# EAGLE schematic Tracker_v5B (EAGLE 9.6.2)

## Sheet 1 of 8: Title
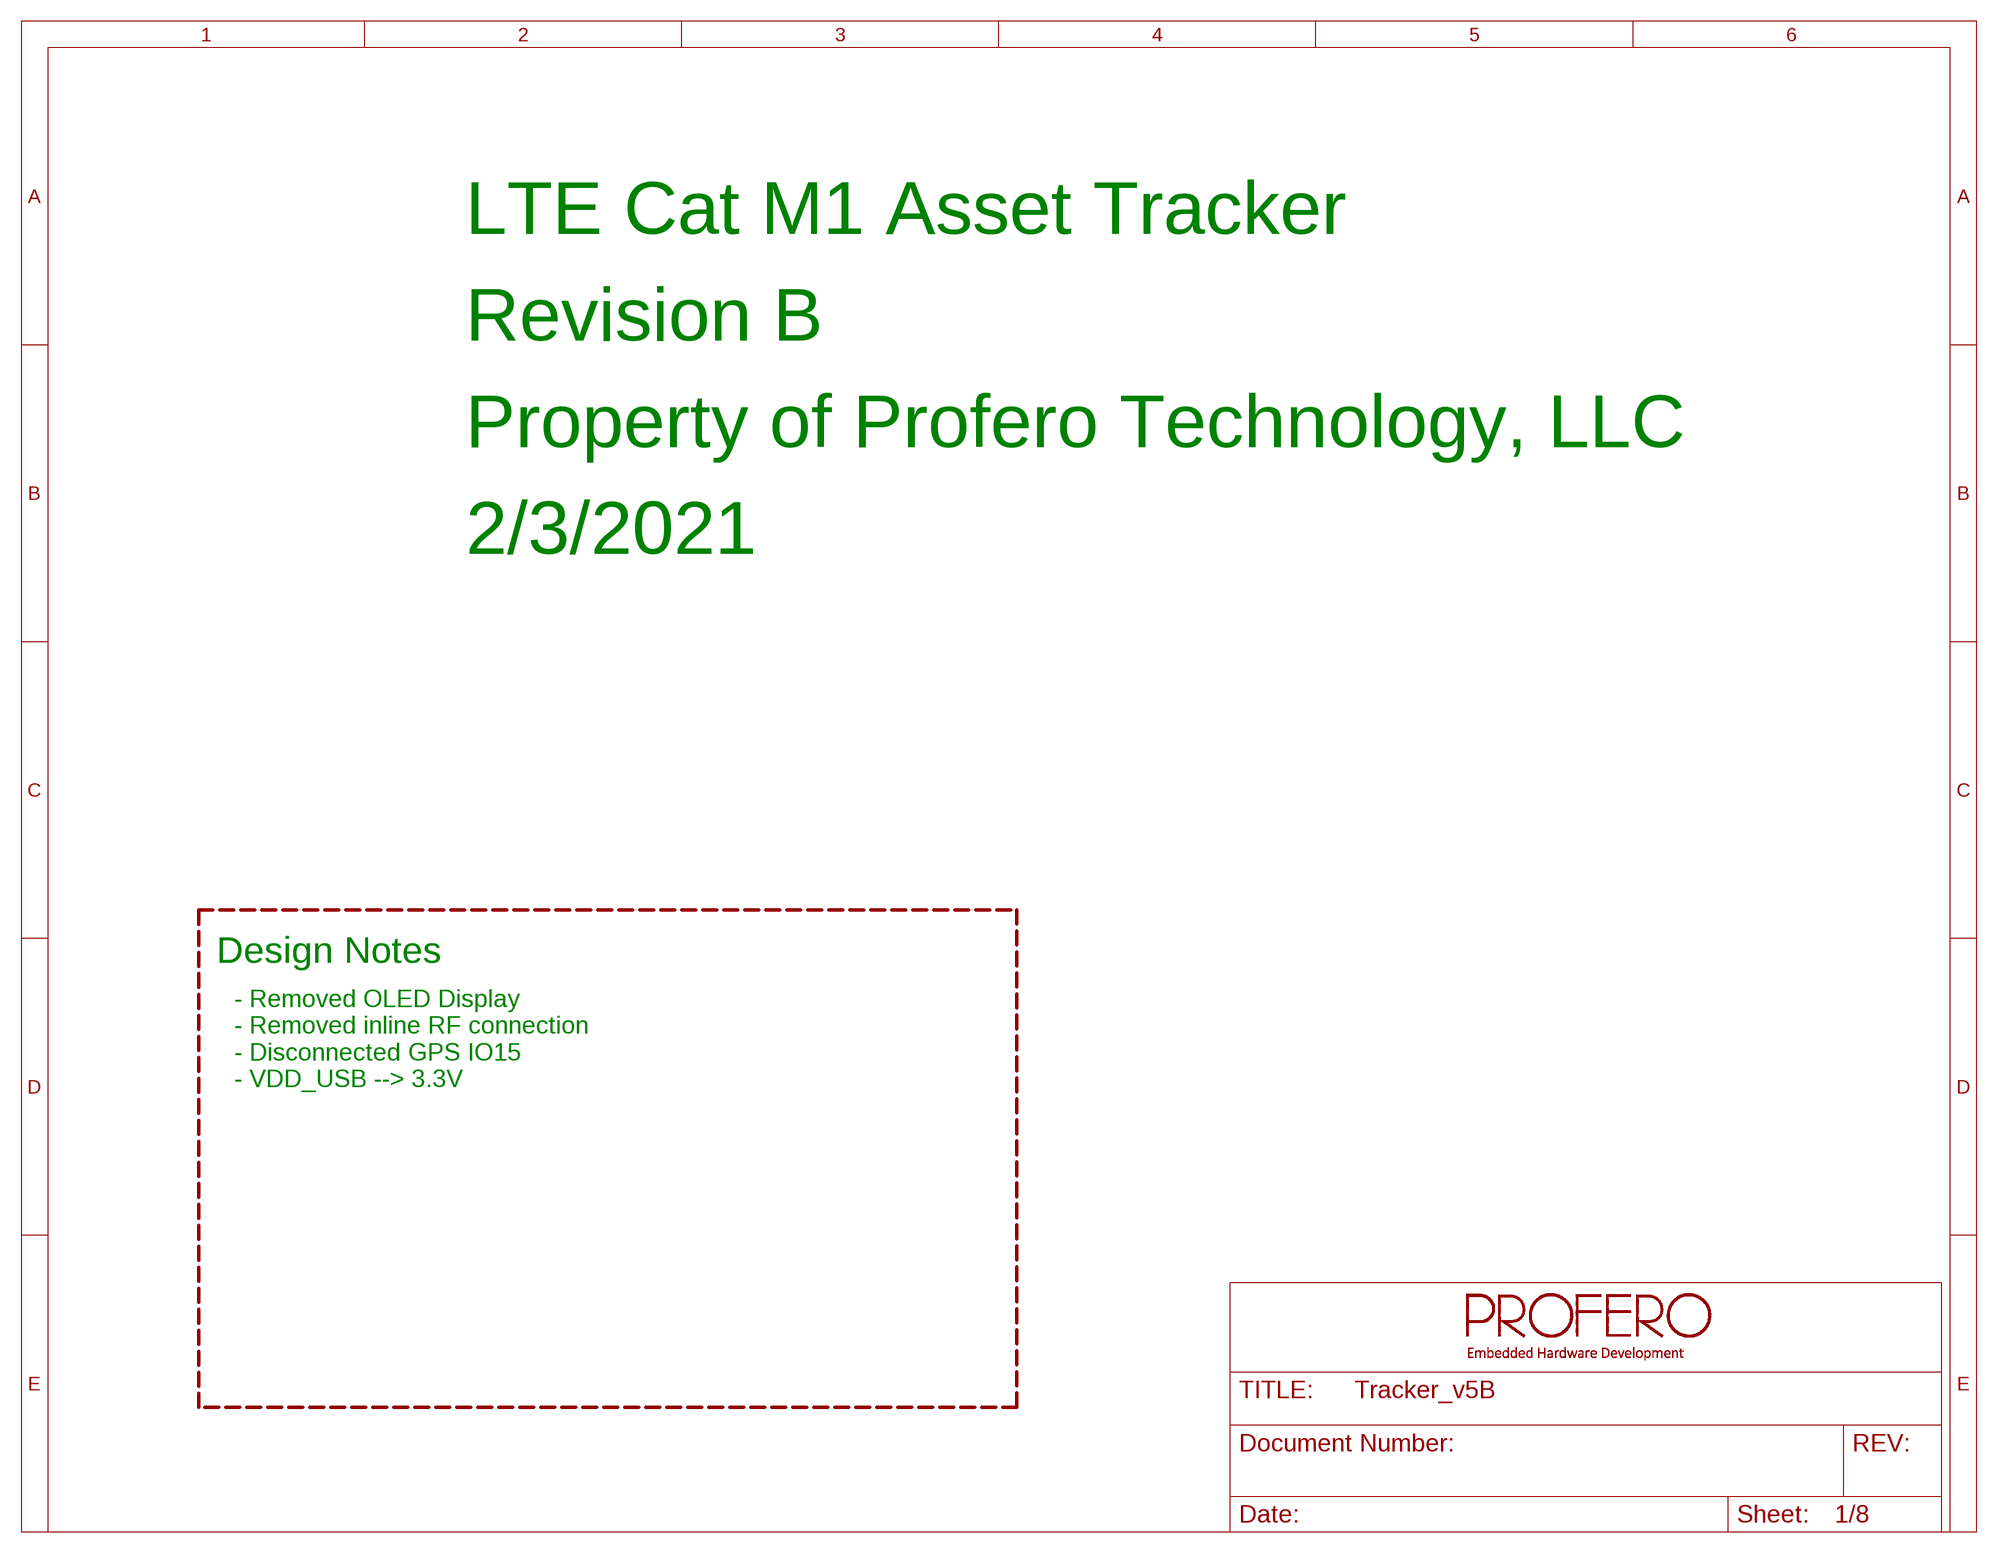
[diagram p0: schematic, sheet 1]

### Notes on the sheet
- LTE Cat M1 Asset Tracker
- Revision B
- Property of Profero Technology, LLC
- 2/3/2021
- Design Notes
- - Removed OLED Display
  - Removed inline RF connection
  - Disconnected GPS IO15
  - VDD_USB --> 3.3V

## Sheet 2 of 8: MCU
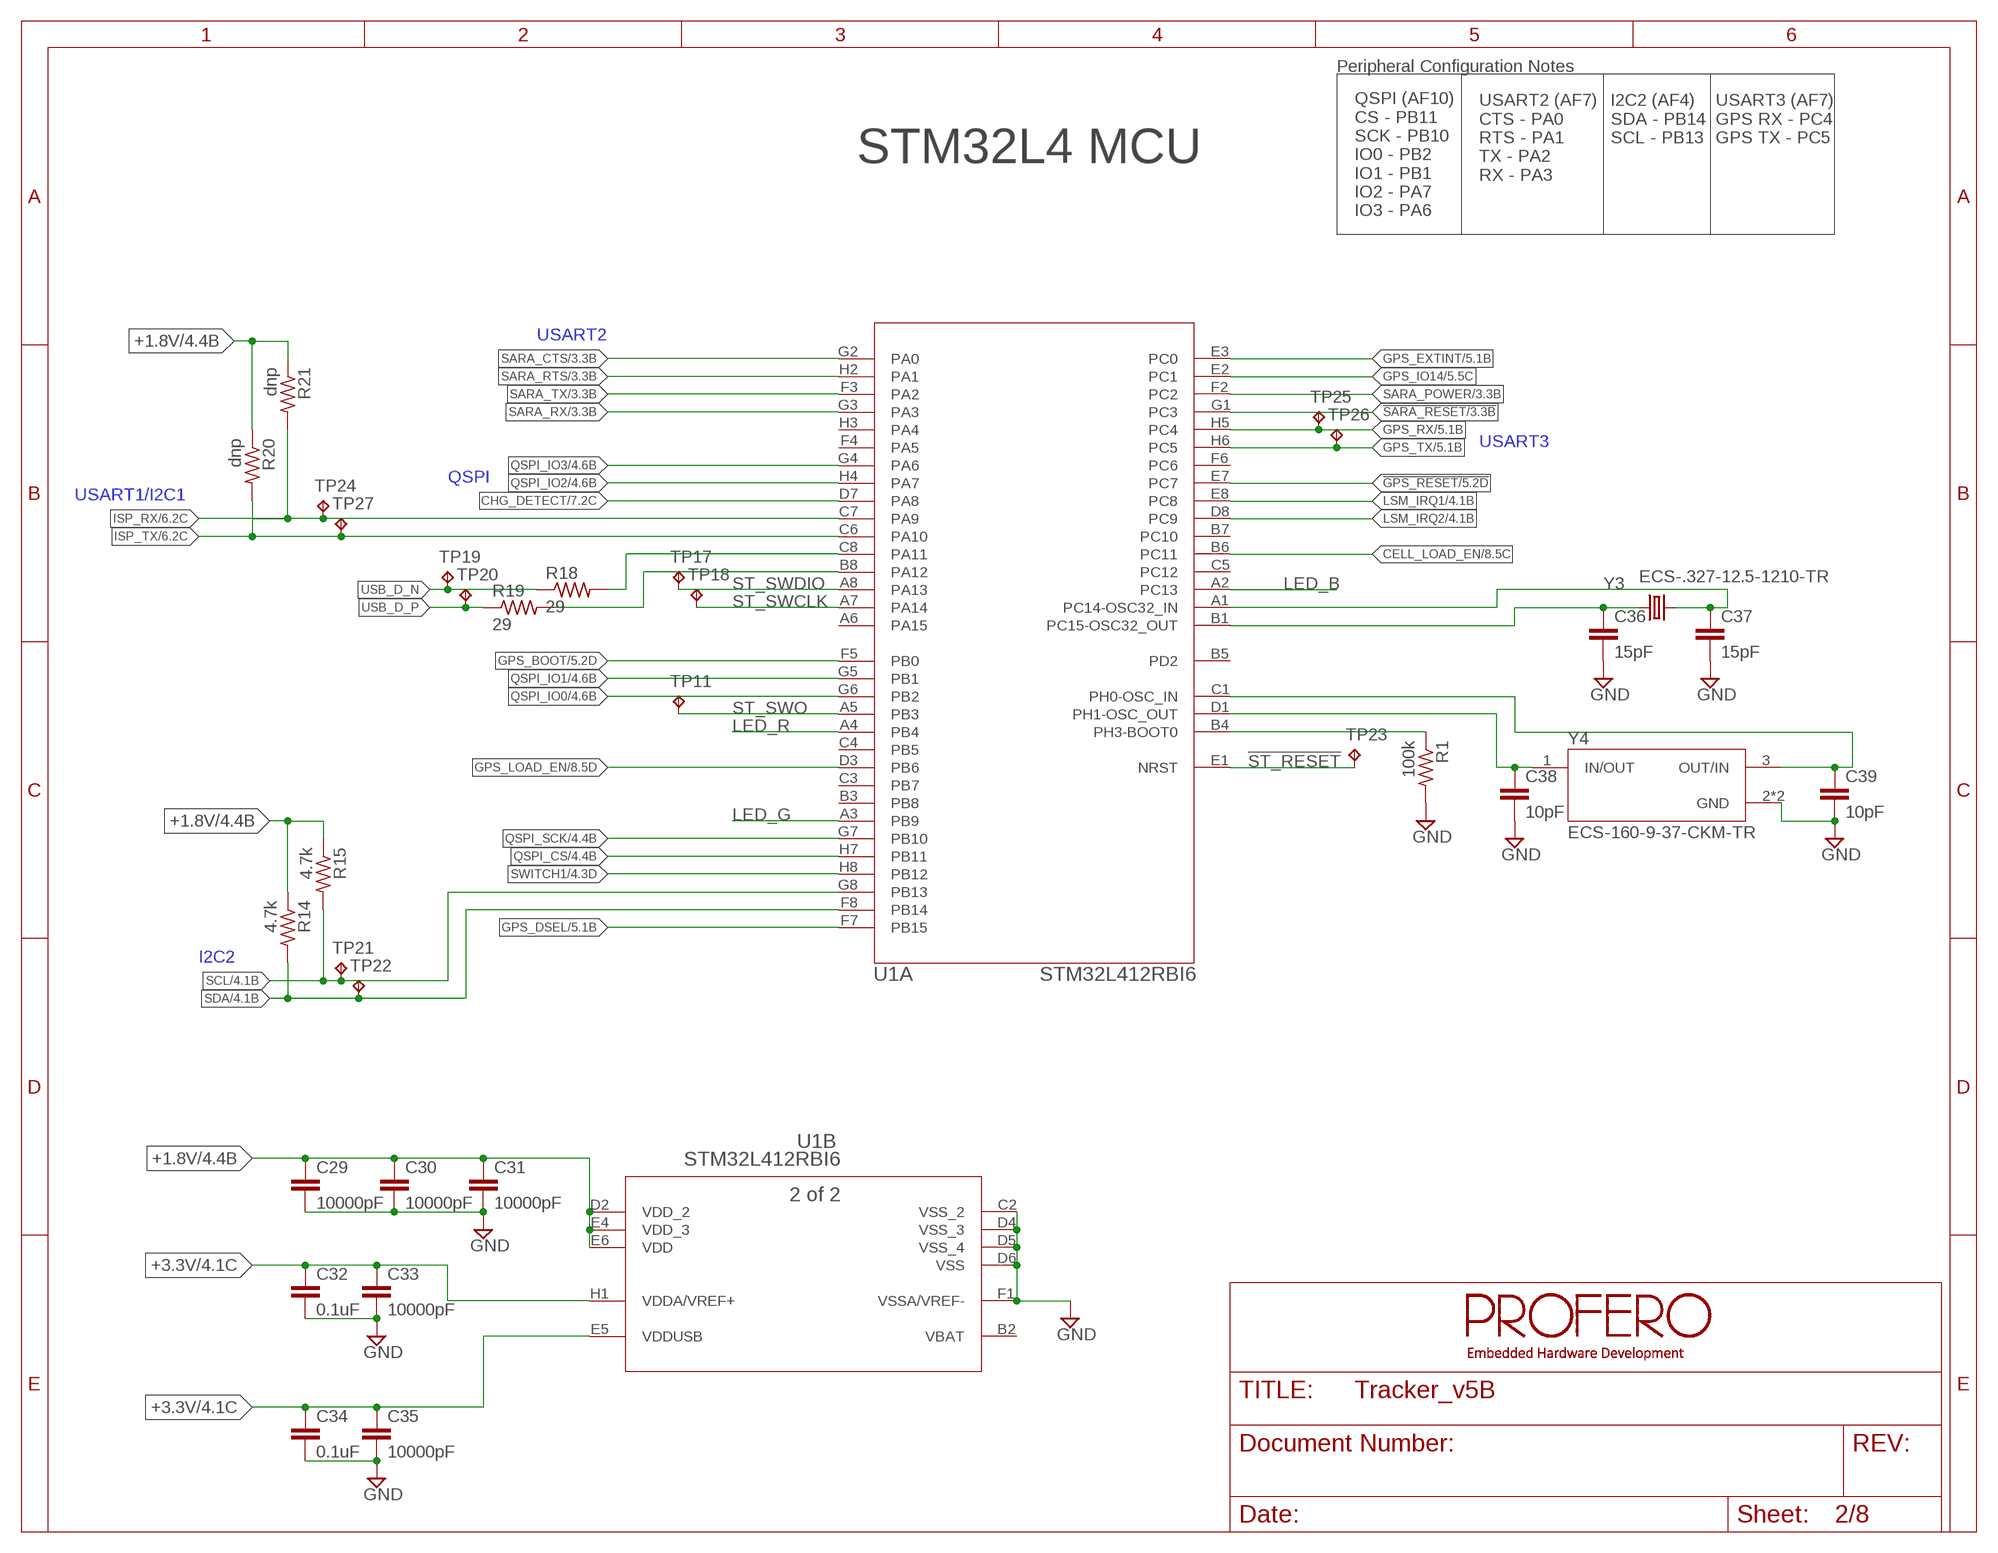
[diagram p1: schematic, sheet 2]

### Parts
C29  10000pF  C-EUC0201  [C0201]
C30  10000pF  C-EUC0201  [C0201]
C31  10000pF  C-EUC0201  [C0201]
C32  0.1uF  C-EUC0201  [C0201]
C33  10000pF  C-EUC0201  [C0201]
C34  0.1uF  C-EUC0201  [C0201]
C35  10000pF  C-EUC0201  [C0201]
C36  15pF  C-EUC0201  [C0201]
C37  15pF  C-EUC0201  [C0201]
C38  10pF  C-EUC0201  [C0201]
C39  10pF  C-EUC0201  [C0201]
R1  100k  R-US_R0201  [R0201]
R14  4.7k  R-US_R0201  [R0201]
R15  4.7k  R-US_R0201  [R0201]
R18  29  R-US_R0201  [R0201]
R19  29  R-US_R0201  [R0201]
R20  dnp  R-US_R0201  [R0201]
R21  dnp  R-US_R0201  [R0201]
TP11  TPTP15R  [TP15R]
TP17  TPTP15R  [TP15R]
TP18  TPTP15R  [TP15R]
TP19  TPTP15R  [TP15R]
TP20  TPTP15R  [TP15R]
TP21  TPTP15R  [TP15R]
TP22  TPTP15R  [TP15R]
TP23  TPTP15R  [TP15R]
TP24  TPTP15R  [TP15R]
TP25  TPTP15R  [TP15R]
TP26  TPTP15R  [TP15R]
TP27  TPTP15R  [TP15R]
U1  STM32L412RBI6  [BGA64C50P8X8_500X500X60N]
Y3  ECS-.327-12.5-1210-TR  [ECS-.327-12.5-1210-TR]
Y4  ECS-160-9-37-CKM-TR  [XTAL_ECS-160-9-37-CKM-TR]

### Nets
!GPS_RESET: U1.E7(A:PC7) ; also sheet 5
!SARA_RESET: U1.G1(A:PC3) ; also sheet 3
!ST_RESET: TP23.TP U1.E1(A:NRST)
+1.8V: C29.1 C30.1 C31.1 R14.1 R15.1 R20.1 R21.1 U1.D2(B:VDD_2) U1.E4(B:VDD_3) U1.E6(B:VDD) ; also sheet 4,5,6,8
+3.3V: C32.1 C33.1 C34.1 C35.1 U1.E5(B:VDDUSB) U1.H1(B:VDDA/VREF+) ; also sheet 4,5,6,8
CELL_LOAD_EN: U1.B6(A:PC11) ; also sheet 8
CHG_DETECT: U1.D7(A:PA8) ; also sheet 7
GND: C29.2 C30.2 C31.2 C32.2 C33.2 C34.2 C35.2 C36.2 C37.2 C38.2 C39.2 R1.2 U1.C2(B:VSS_2) U1.D4(B:VSS_3) U1.D5(B:VSS_4) U1.D6(B:VSS) U1.F1(B:VSSA/VREF-) Y4.2(GND) Y4.4(GND) ; also sheet 3,4,5,6,7,8
GPS_BOOT: U1.F5(A:PB0) ; also sheet 5
GPS_DSEL: U1.F7(A:PB15) ; also sheet 5
GPS_EXTINT: U1.E3(A:PC0) ; also sheet 5
GPS_IO14: U1.E2(A:PC1) ; also sheet 5
GPS_LOAD_EN: U1.D3(A:PB6) ; also sheet 8
GPS_RX: TP25.TP U1.H5(A:PC4) ; also sheet 5
GPS_TX: TP26.TP U1.H6(A:PC5) ; also sheet 5
ISP_RX: R21.2 TP24.TP U1.C7(A:PA9) ; also sheet 6
ISP_TX: R20.2 TP27.TP U1.C6(A:PA10) ; also sheet 6
LED_B: U1.A2(A:PC13) ; also sheet 4
LED_G: U1.A3(A:PB9) ; also sheet 4
LED_R: U1.A4(A:PB4) ; also sheet 4
LSM_IRQ1: U1.E8(A:PC8) ; also sheet 4
LSM_IRQ2: U1.D8(A:PC9) ; also sheet 4
N$25_N [diff]: R18.2 U1.C8(A:PA11)
N$25_P [diff]: R19.2 U1.B8(A:PA12)
N$27: C36.1 U1.B1(A:PC15-OSC32_OUT) Y3.1
N$28: C37.1 U1.A1(A:PC14-OSC32_IN) Y3.2
N$29: C39.1 U1.C1(A:PH0-OSC_IN) Y4.3(OUT/IN)
N$30: C38.1 U1.D1(A:PH1-OSC_OUT) Y4.1(IN/OUT)
N$34: R1.1 U1.B4(A:PH3-BOOT0)
QSPI_CS: U1.H7(A:PB11) ; also sheet 4
QSPI_IO0: U1.G6(A:PB2) ; also sheet 4
QSPI_IO1: U1.G5(A:PB1) ; also sheet 4
QSPI_IO2: U1.H4(A:PA7) ; also sheet 4
QSPI_IO3: U1.G4(A:PA6) ; also sheet 4
QSPI_SCK: U1.G7(A:PB10) ; also sheet 4
SARA_CTS: U1.G2(A:PA0) ; also sheet 3
SARA_POWER: U1.F2(A:PC2) ; also sheet 3
SARA_RTS: U1.H2(A:PA1) ; also sheet 3
SARA_RX: U1.G3(A:PA3) ; also sheet 3
SARA_TX: U1.F3(A:PA2) ; also sheet 3
SCL: R15.2 TP21.TP U1.G8(A:PB13) ; also sheet 4,8
SDA: R14.2 TP22.TP U1.F8(A:PB14) ; also sheet 4,8
ST_SWCLK: TP18.TP U1.A7(A:PA14)
ST_SWDIO: TP17.TP U1.A8(A:PA13)
ST_SWO: TP11.TP U1.A5(A:PB3)
SWITCH1: U1.H8(A:PB12) ; also sheet 4
USB_D_N [diff]: R18.1 TP19.TP
USB_D_P [diff]: R19.1 TP20.TP
Unconnected: U1.A6(A:PA15) U1.B3(A:PB8) U1.B5(A:PD2) U1.B7(A:PC10) U1.C3(A:PB7) U1.C4(A:PB5) U1.C5(A:PC12) U1.F4(A:PA5) U1.F6(A:PC6) U1.H3(A:PA4)

### Notes on the sheet
- Peripheral Configuration Notes
- I2C2 (AF4)
  SDA - PB14
  SCL - PB13
- USART3 (AF7)
  GPS RX - PC4
  GPS TX - PC5
- STM32L4 MCU
- USART2 (AF7)
  CTS - PA0
  RTS - PA1
  TX - PA2
  RX - PA3
- QSPI (AF10)
  CS - PB11
  SCK - PB10
  IO0 - PB2
  IO1 - PB1
  IO2 - PA7
  IO3 - PA6
- USART2
- USART3
- QSPI
- USART1/I2C1
- I2C2

## Sheet 3 of 8: Cellular
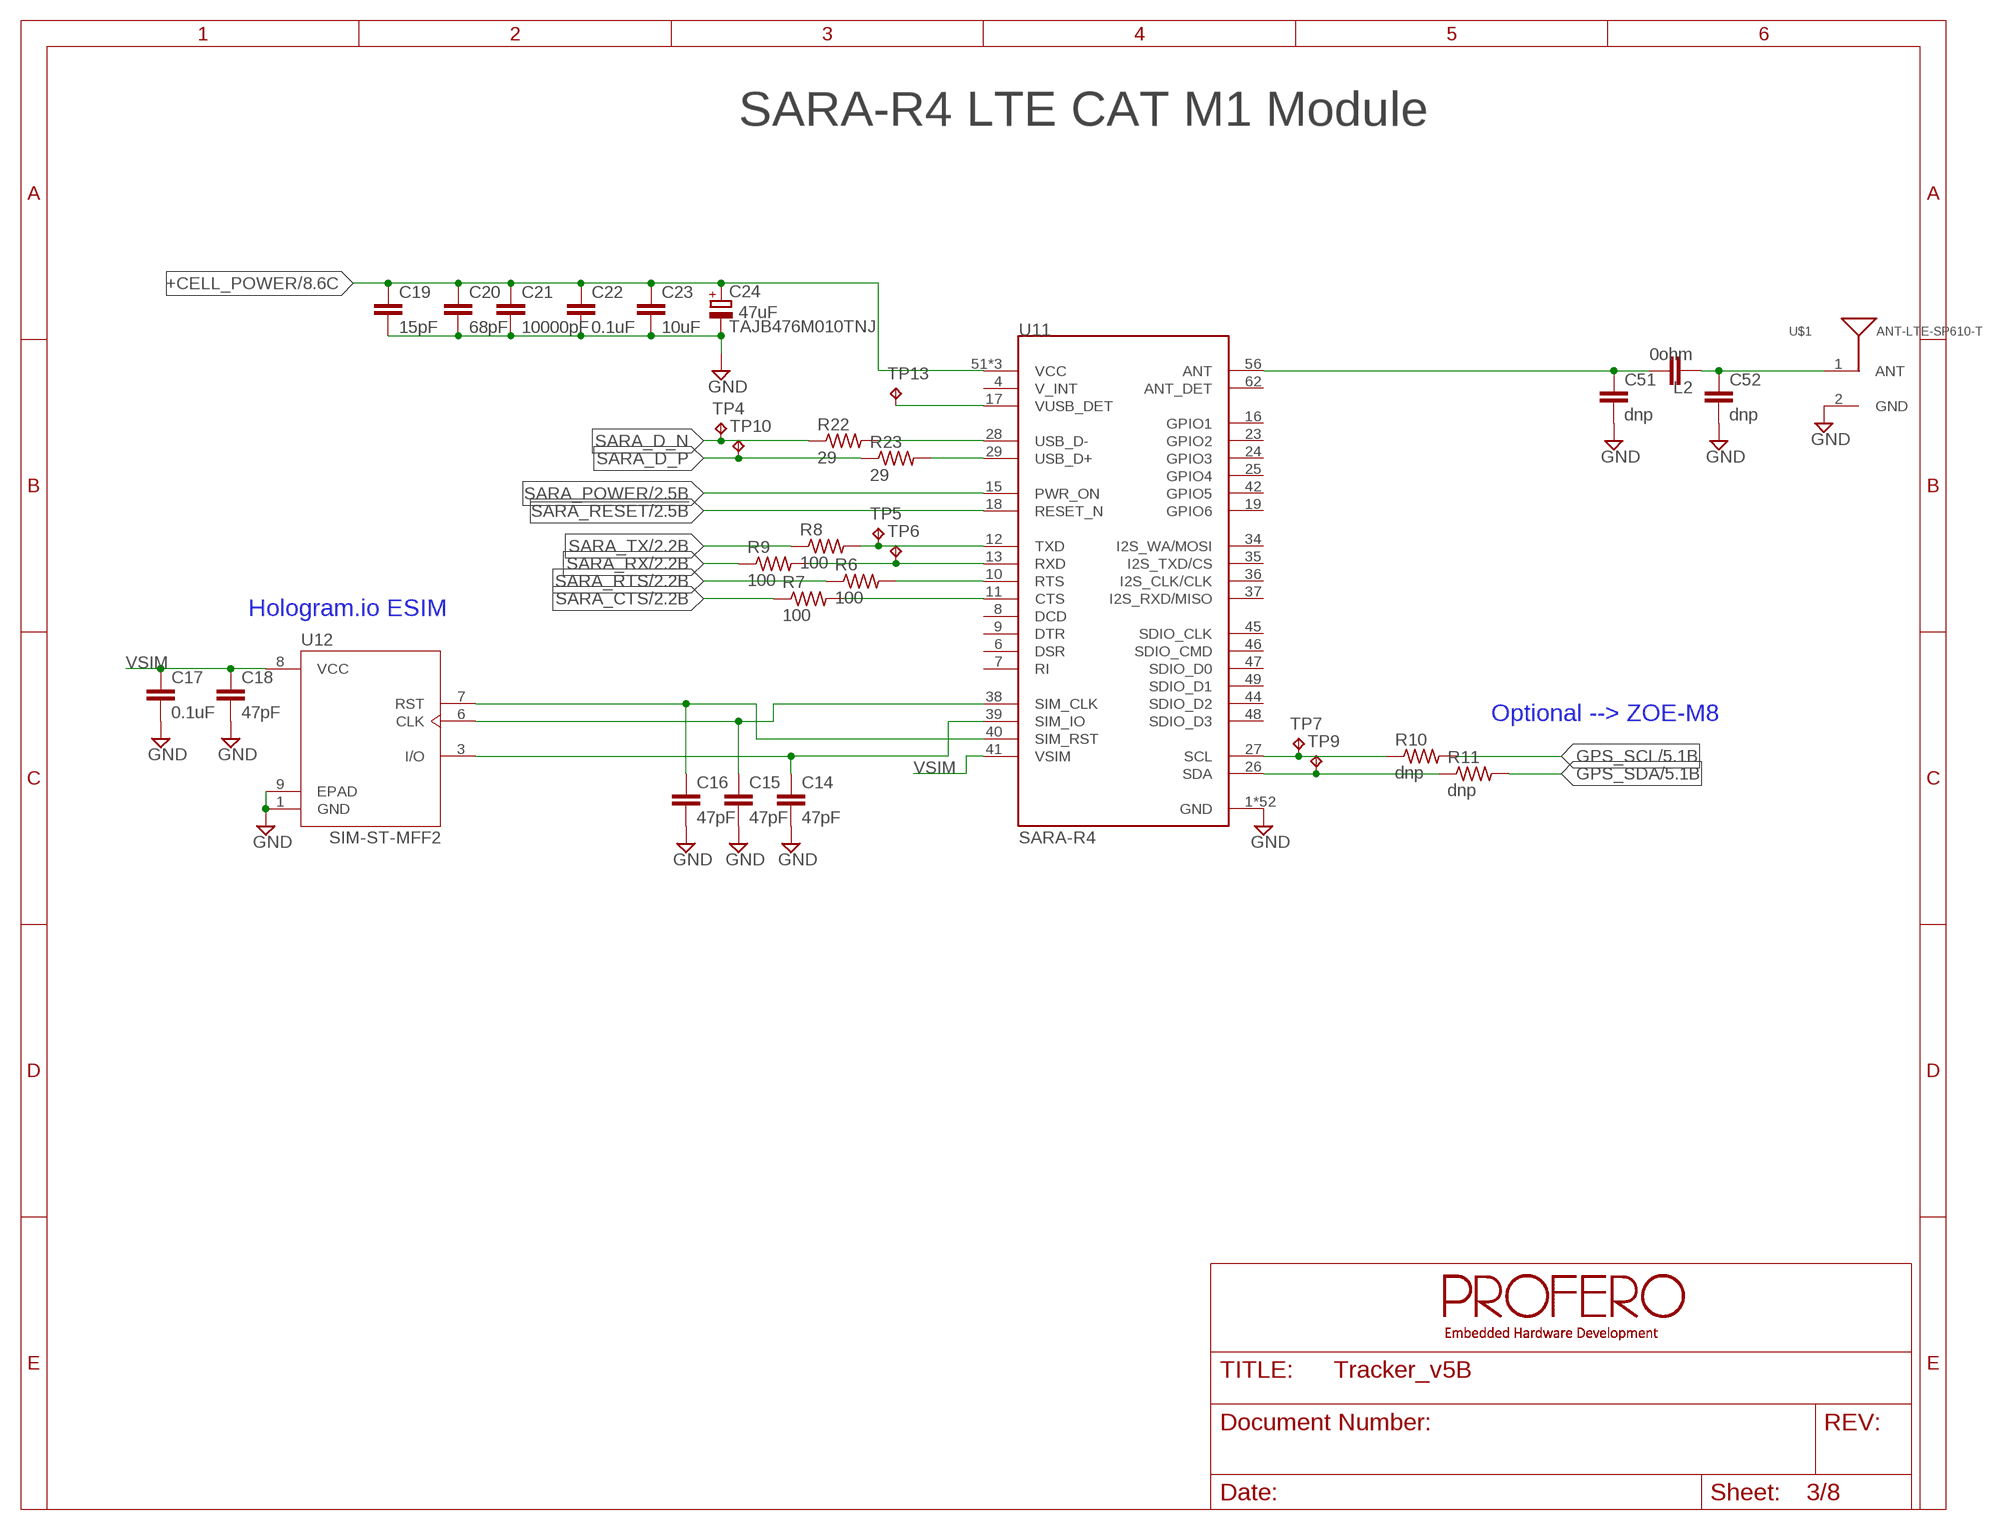
[diagram p2: schematic, sheet 3]

### Parts
C14  47pF  C-EUC0201  [C0201]
C15  47pF  C-EUC0201  [C0201]
C16  47pF  C-EUC0201  [C0201]
C17  0.1uF  C-EUC0201  [C0201]
C18  47pF  C-EUC0201  [C0201]
C19  15pF  C-EUC0201  [C0201]
C20  68pF  C-EUC0201  [C0201]
C21  10000pF  C-EUC0201  [C0201]
C22  0.1uF  C-EUC0201  [C0201]
C23  10uF  C-EUC0603  [C0603]
C24  TAJB476M010TNJ  C-POL_TANTALUM-1411(3528-METRIC)  [CAPMP3528X210N]
C51  dnp  C-EUC0402  [C0402]
C52  dnp  C-EUC0402  [C0402]
L2  0ohm  C-EUC0402  [C0402]
R6  100  R-US_R0201  [R0201]
R7  100  R-US_R0201  [R0201]
R8  100  R-US_R0201  [R0201]
R9  100  R-US_R0201  [R0201]
R10  dnp  R-US_R0201  [R0201]
R11  dnp  R-US_R0201  [R0201]
R22  29  R-US_R0201  [R0201]
R23  29  R-US_R0201  [R0201]
TP4  TPTP15R  [TP15R]
TP5  TPTP15R  [TP15R]
TP6  TPTP15R  [TP15R]
TP7  TPTP15R  [TP15R]
TP9  TPTP15R  [TP15R]
TP10  TPTP15R  [TP15R]
TP13  TPTP15R  [TP15R]
U11  SARA-R4  [SARA-R4]
U12  SIM-ST-MFF2  [PSON127P500X600X82-9N]
U$1  ANT-LTE-SP610-T  [ANT-LTE-SP610-T]

### Nets
!SARA_RESET: U11.18(RESET_N) ; also sheet 2
+CELL_POWER: C19.1 C20.1 C21.1 C22.1 C23.1 C24.1(+) U11.51(VCC) U11.52(VCC) U11.53(VCC) ; also sheet 8
GND: C14.2 C15.2 C16.2 C17.2 C18.2 C19.2 C20.2 C21.2 C22.2 C23.2 C24.2(-) C51.2 C52.2 U11.1(GND) U11.3(GND) U11.5(GND) U11.14(GND) U11.20(GND) U11.21(GND) U11.22(GND) U11.30(GND) U11.32(GND) U11.43(GND) U11.50(GND) U11.54(GND) U11.55(GND) U11.57(GND) U11.58(GND) U11.59(GND) U11.60(GND) U11.61(GND) U11.63(GND) U11.64(GND) U11.65(GND) U11.66(GND) U11.67(GND) U11.68(GND) U11.69(GND) U11.70(GND) U11.71(GND) U11.72(GND) U11.73(GND) U11.74(GND) U11.75(GND) U11.76(GND) U11.77(GND) U11.78(GND) U11.79(GND) U11.80(GND) U11.81(GND) U11.82(GND) U11.83(GND) U11.84(GND) U11.85(GND) U11.86(GND) U11.87(GND) U11.88(GND) U11.89(GND) U11.90(GND) U11.91(GND) U11.92(GND) U11.93(GND) U11.94(GND) U11.95(GND) U11.96(GND) U12.1(GND) U12.9(EPAD) U$1.2(GND) ; also sheet 2,4,5,6,7,8
GPS_SCL: R10.2 ; also sheet 5
GPS_SDA: R11.2 ; also sheet 5
N$9: R9.2 TP6.TP U11.13(RXD)
N$10: R8.2 TP5.TP U11.12(TXD)
N$11: R7.2 U11.11(CTS)
N$12: R6.2 U11.10(RTS)
N$16: C15.1 U11.38(SIM_CLK) U12.6(CLK)
N$17: C16.1 U11.40(SIM_RST) U12.7(RST)
N$18: C51.1 L2.1 U11.56(ANT)
N$19: C14.1 U11.39(SIM_IO) U12.3(I/O)
N$20: R10.1 TP7.TP U11.27(SCL)
N$21: R11.1 TP9.TP U11.26(SDA)
N$32: R22.2 U11.28(USB_D-)
N$33: R23.2 U11.29(USB_D+)
N$55: C52.1 L2.2 U$1.1(ANT)
N$58: TP13.TP U11.17(VUSB_DET)
SARA_CTS: R7.1 ; also sheet 2
SARA_D_N [diff]: R22.1 TP4.TP
SARA_D_P [diff]: R23.1 TP10.TP
SARA_POWER: U11.15(PWR_ON) ; also sheet 2
SARA_RTS: R6.1 ; also sheet 2
SARA_RX: R9.1 ; also sheet 2
SARA_TX: R8.1 ; also sheet 2
VSIM: C17.1 C18.1 U11.41(VSIM) U12.8(VCC)
Unconnected: U11.4(V_INT) U11.6(DSR) U11.7(RI) U11.8(DCD) U11.9(DTR) U11.16(GPIO1) U11.19(GPIO6) U11.23(GPIO2) U11.24(GPIO3) U11.25(GPIO4) U11.34(I2S_WA/MOSI) U11.35(I2S_TXD/CS) U11.36(I2S_CLK/CLK) U11.37(I2S_RXD/MISO) U11.42(GPIO5) U11.44(SDIO_D2) U11.45(SDIO_CLK) U11.46(SDIO_CMD) U11.47(SDIO_D0) U11.48(SDIO_D3) U11.49(SDIO_D1) U11.62(ANT_DET)

### Notes on the sheet
- SARA-R4 LTE CAT M1 Module
- 47uF
- Hologram.io ESIM
- Optional --> ZOE-M8

## Sheet 4 of 8: Sensors & Peripherals
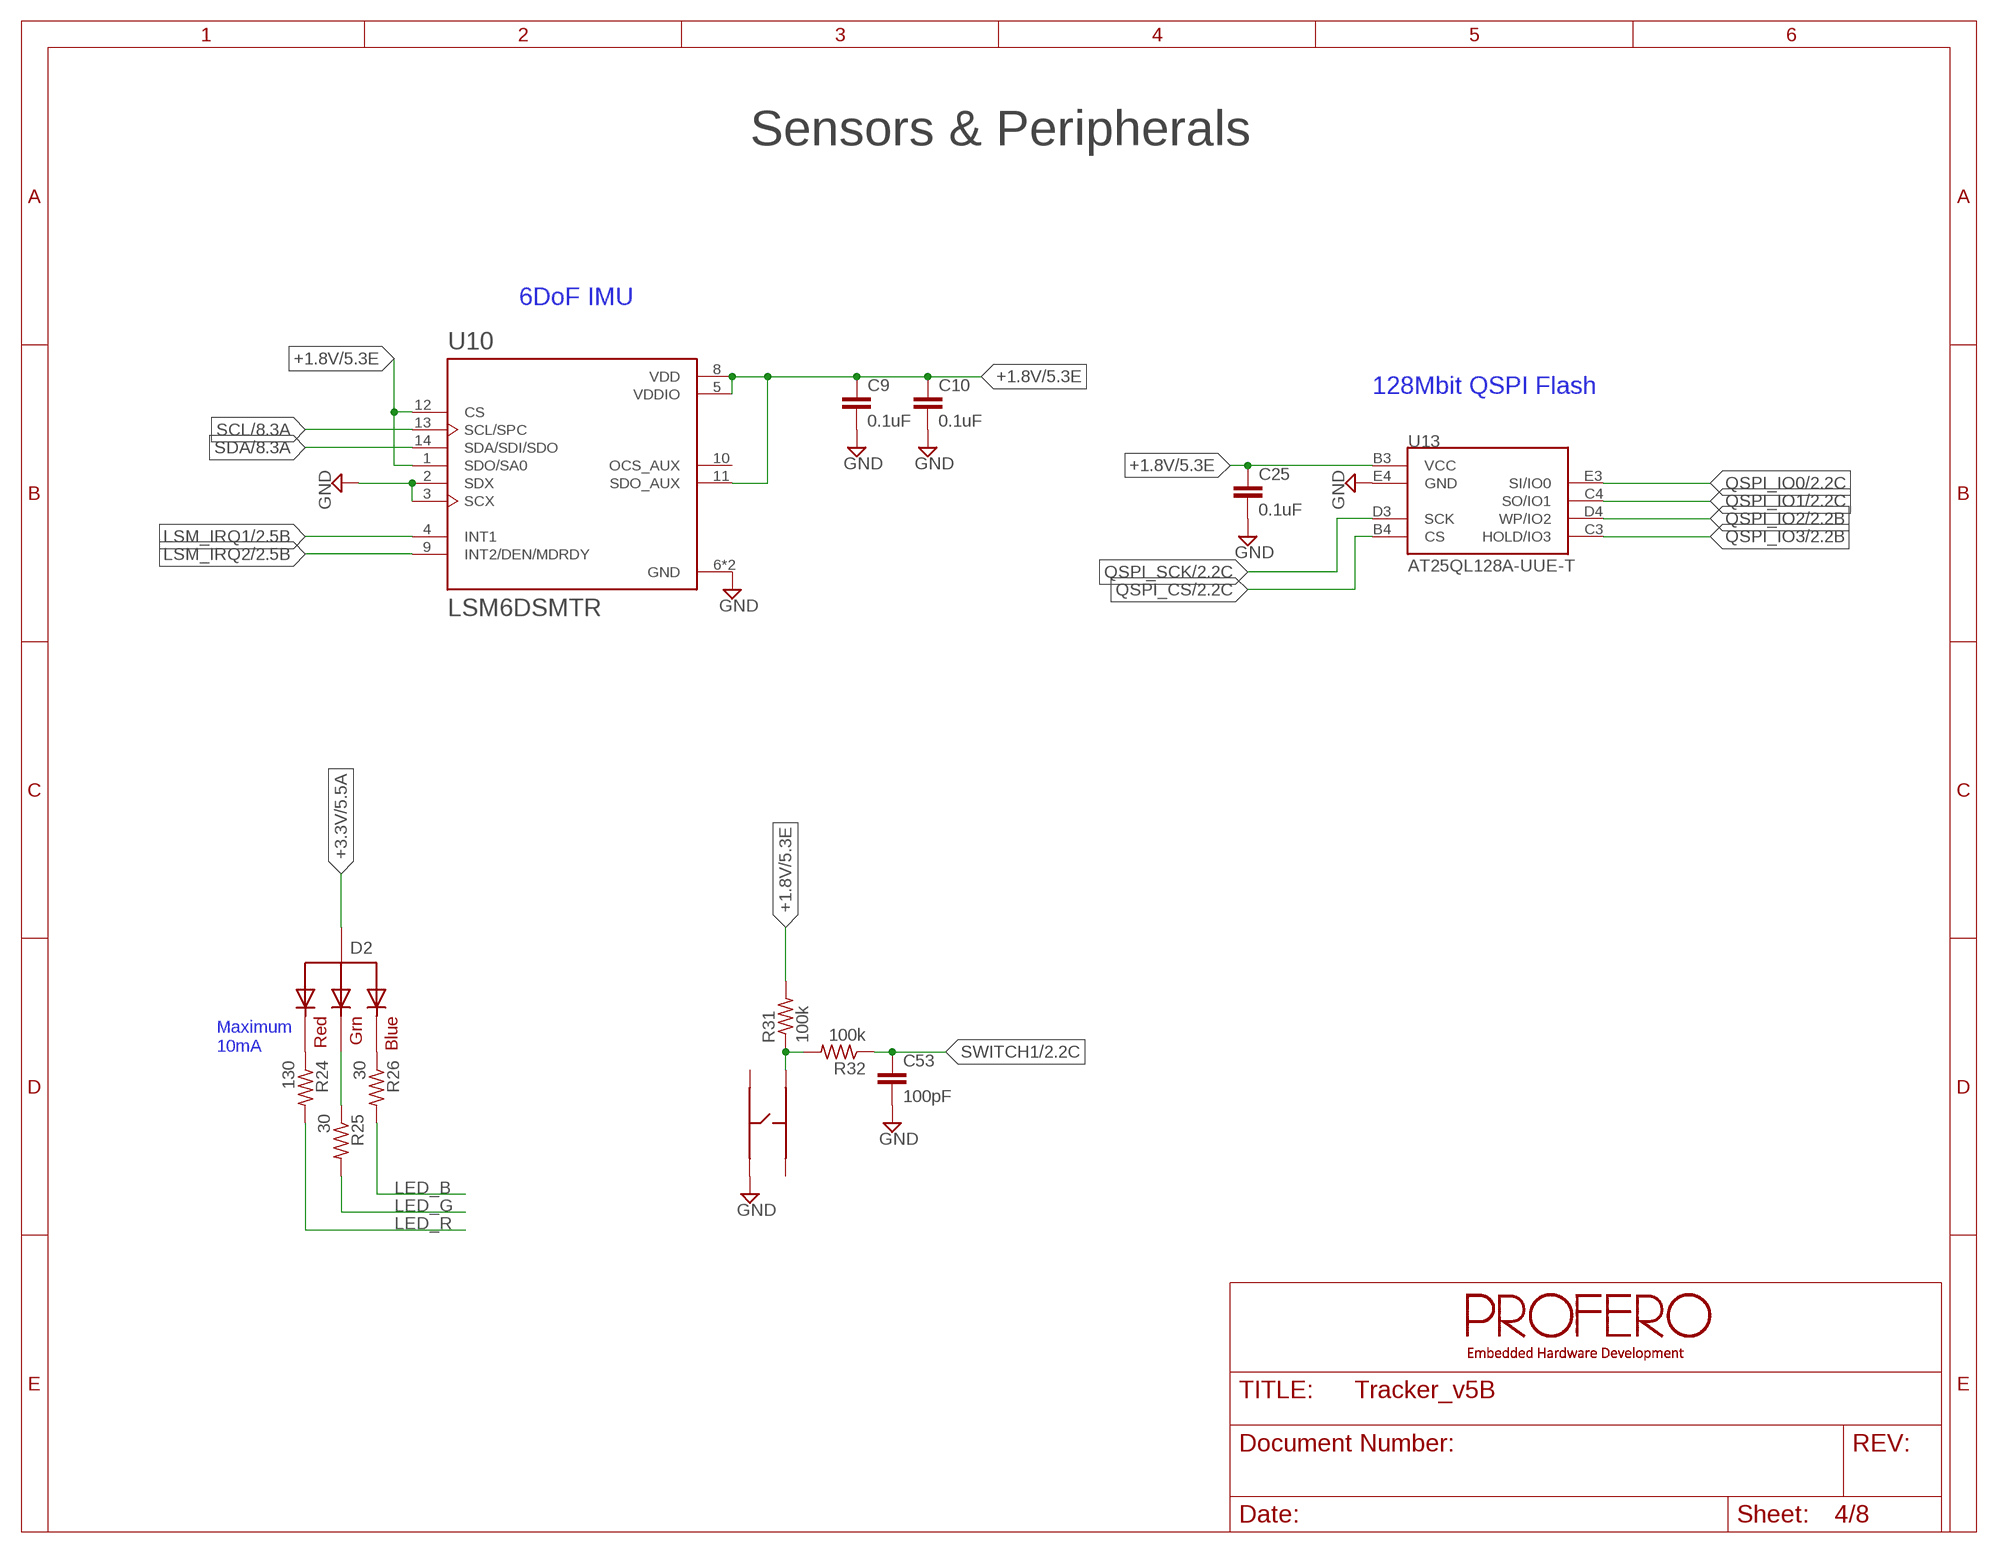
[diagram p3: schematic, sheet 4]

### Parts
C9  0.1uF  C-EUC0201  [C0201]
C10  0.1uF  C-EUC0201  [C0201]
C25  0.1uF  C-EUC0201  [C0201]
C53  100pF  C-EUC0201  [C0201]
D2  CLMVC-FKA  [CLMVC-FKA]
R24  130  R-US_R0201  [R0201]
R25  30  R-US_R0201  [R0201]
R26  30  R-US_R0201  [R0201]
R31  100k  R-US_R0201  [R0201]
R32  100k  R-US_R0201  [R0201]
S1  EVQ-7PJ  EVQ-7P(J/A)  [EVQ-7PJ/A]
U10  LSM6DSMTR  [PQFN50P300X250X86-14N]
U13  AT25QL128A-UUE-T  [21-WLCSP]

### Nets
+1.8V: C9.1 C10.1 C25.1 R31.2 U10.1(SDO/SA0) U10.5(VDDIO) U10.8(VDD) U10.11(SDO_AUX) U10.12(CS) U13.B3(VCC) ; also sheet 2,5,6,8
+3.3V: D2.B1(VCC) ; also sheet 2,5,6,8
GND: C9.2 C10.2 C25.2 C53.2 S1.P$1 U10.2(SDX) U10.3(SCX) U10.6(GND) U10.7(GND) U13.E4(GND) ; also sheet 2,3,5,6,7,8
LED_B: R26.2 ; also sheet 2
LED_G: R25.2 ; also sheet 2
LED_R: R24.2 ; also sheet 2
LSM_IRQ1: U10.4(INT1) ; also sheet 2
LSM_IRQ2: U10.9(INT2/DEN/MDRDY) ; also sheet 2
N$35: D2.B4(RED) R24.1
N$36: D2.B3(GREEN) R25.1
N$37: D2.B2(BLUE) R26.1
N$57: R31.1 R32.2 S1.P$4
QSPI_CS: U13.B4(CS) ; also sheet 2
QSPI_IO0: U13.E3(SI/IO0) ; also sheet 2
QSPI_IO1: U13.C4(SO/IO1) ; also sheet 2
QSPI_IO2: U13.D4(WP/IO2) ; also sheet 2
QSPI_IO3: U13.C3(HOLD/IO3) ; also sheet 2
QSPI_SCK: U13.D3(SCK) ; also sheet 2
SCL: U10.13(SCL/SPC) ; also sheet 2,8
SDA: U10.14(SDA/SDI/SDO) ; also sheet 2,8
SWITCH1: C53.1 R32.1 ; also sheet 2
Unconnected: S1.P$2 S1.P$3 U10.10(OCS_AUX)

### Notes on the sheet
- Sensors & Peripherals
- 6DoF IMU
- 128Mbit QSPI Flash
- Maximum
  10mA

## Sheet 5 of 8: GPS
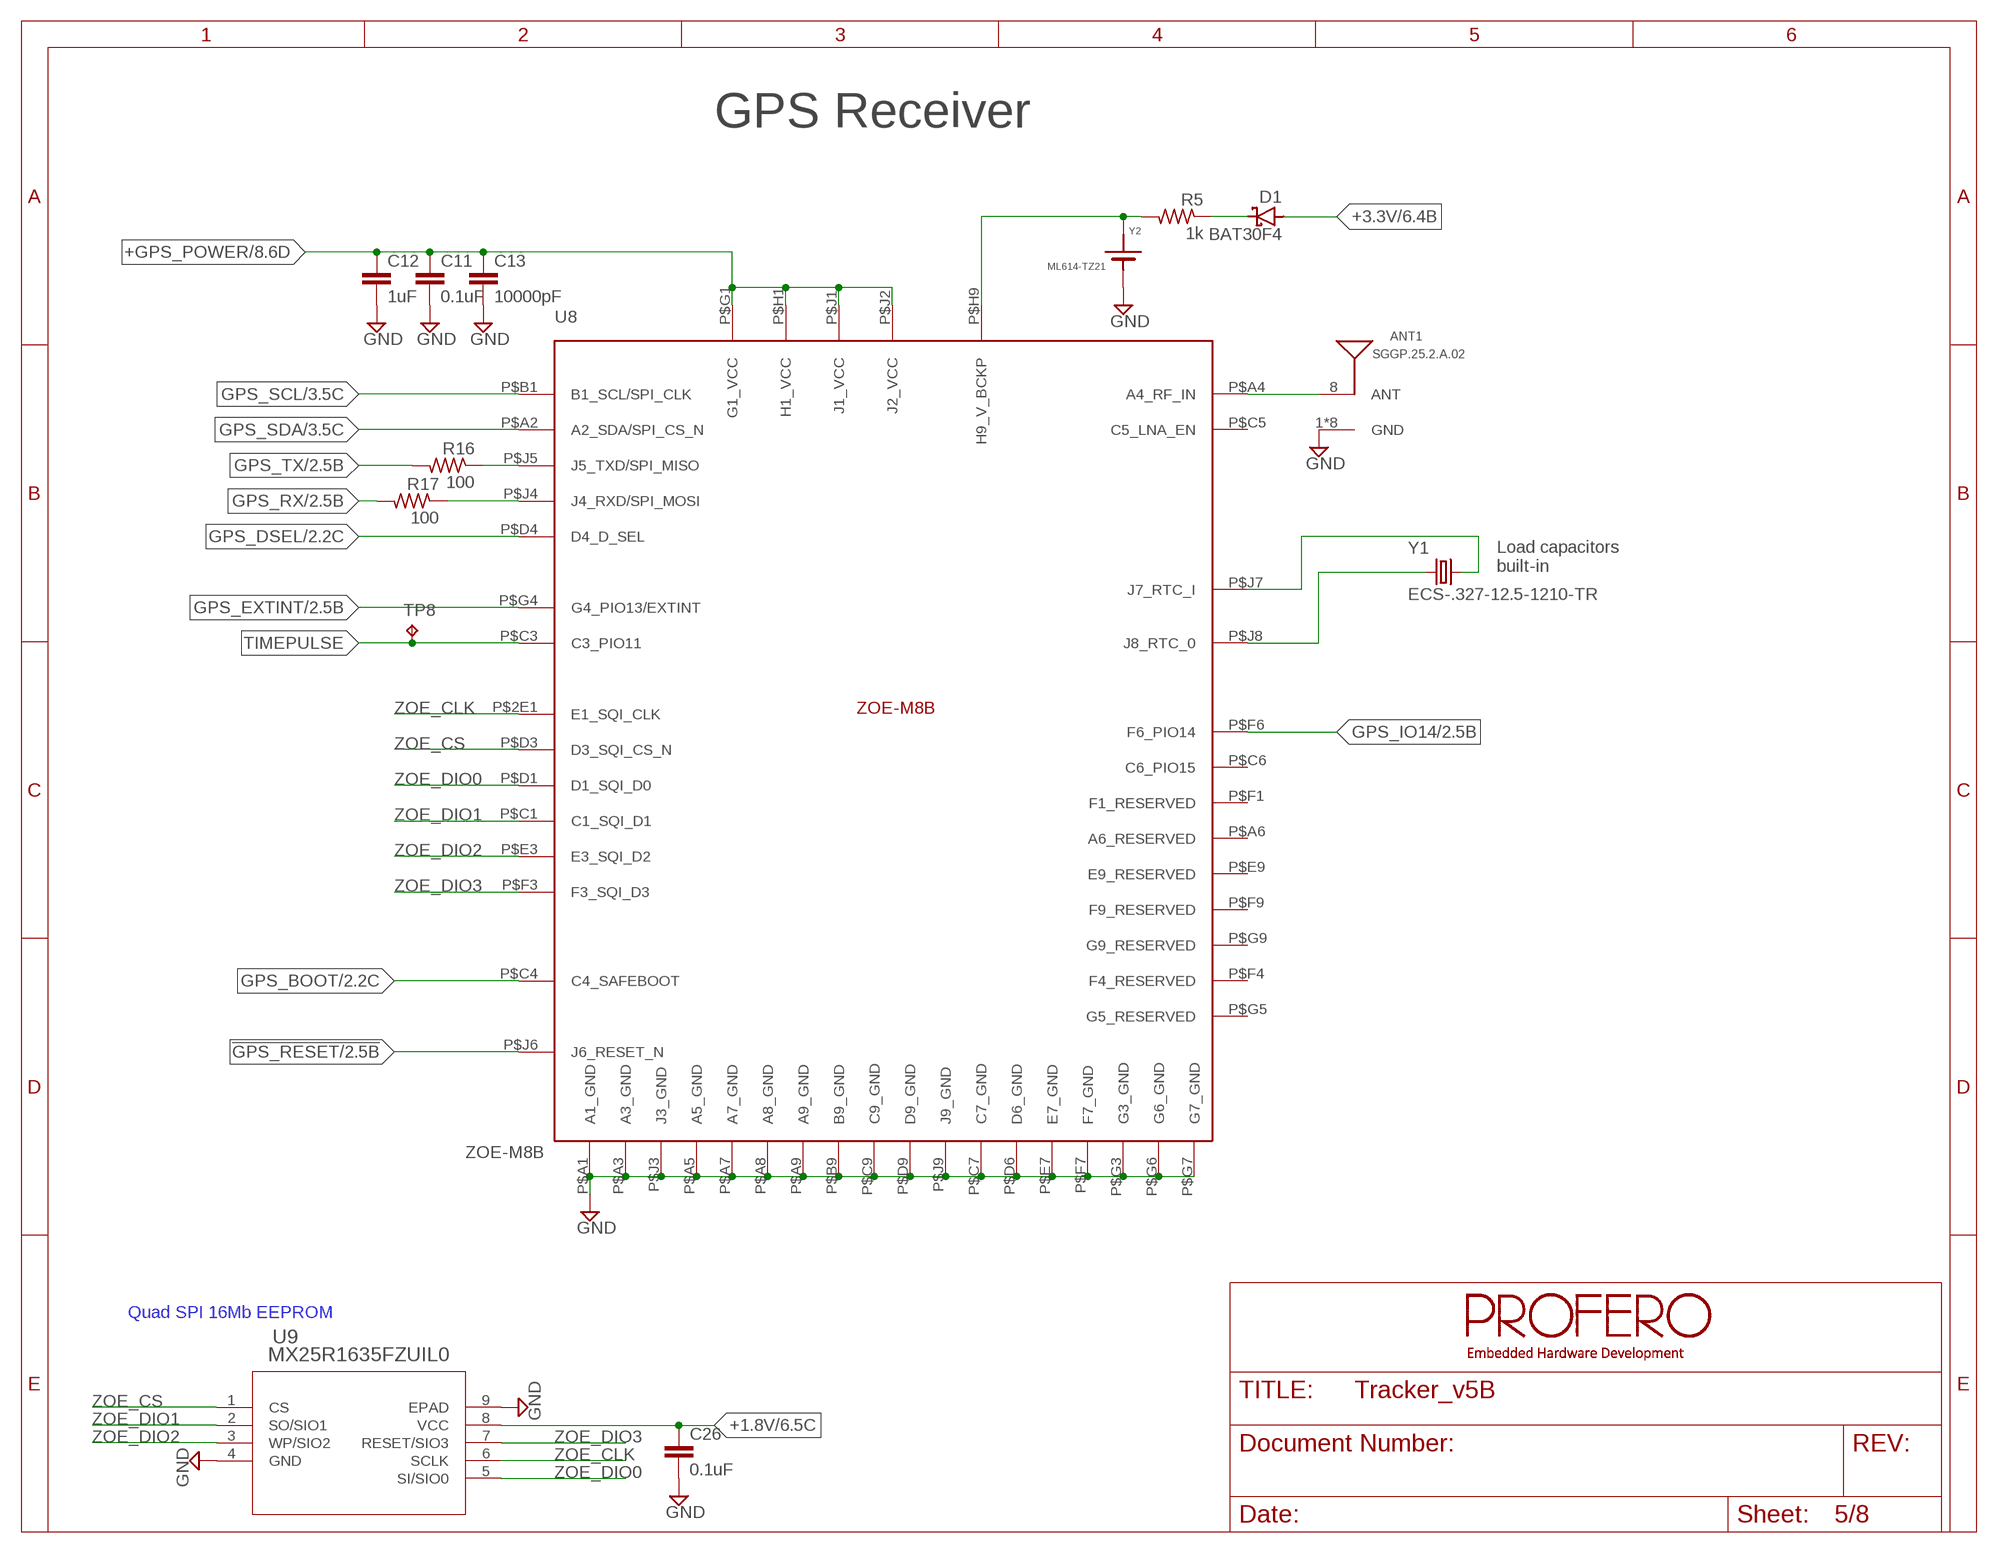
[diagram p4: schematic, sheet 5]

### Parts
ANT1  SGGP.25.2.A.02  [SGGP.25.2.A.02]
C11  0.1uF  C-EUC0201  [C0201]
C12  1uF  C-EUC0201  [C0201]
C13  10000pF  C-EUC0201  [C0201]
C26  0.1uF  C-EUC0201  [C0201]
D1  BAT30F4  [BAT30F4]
R5  1k  R-US_R0201  [R0201]
R16  100  R-US_R0201  [R0201]
R17  100  R-US_R0201  [R0201]
TP8  TPTP15R  [TP15R]
U8  ZOE-M8B  [ZOE-M8]
U9  MX25R1635FZUIL0  [USON-8L-2X3X0P6_MAC]
Y1  ECS-.327-12.5-1210-TR  [ECS-.327-12.5-1210-TR]
Y2  ML614-TZ21  [ML614-TZ21]

### Nets
!GPS_RESET: U8.P$J6(J6_RESET_N) ; also sheet 2
+1.8V: C26.1 U9.8(VCC) ; also sheet 2,4,6,8
+3.3V: D1.2(A) ; also sheet 2,4,6,8
+GPS_POWER: C11.1 C12.1 C13.1 U8.P$G1(G1_VCC) U8.P$H1(H1_VCC) U8.P$J1(J1_VCC) U8.P$J2(J2_VCC) ; also sheet 8
GND: ANT1.1(GND) ANT1.2(GND) ANT1.3(GND) ANT1.4(GND) ANT1.5(GND) ANT1.6(GND) ANT1.7(GND) ANT1.9(GND) C11.2 C12.2 C13.2 C26.2 U8.P$A1(A1_GND) U8.P$A3(A3_GND) U8.P$A5(A5_GND) U8.P$A7(A7_GND) U8.P$A8(A8_GND) U8.P$A9(A9_GND) U8.P$B9(B9_GND) U8.P$C7(C7_GND) U8.P$C9(C9_GND) U8.P$D6(D6_GND) U8.P$D9(D9_GND) U8.P$E7(E7_GND) U8.P$F7(F7_GND) U8.P$G3(G3_GND) U8.P$G6(G6_GND) U8.P$G7(G7_GND) U8.P$J3(J3_GND) U8.P$J9(J9_GND) U9.4(GND) U9.9(EPAD) Y2.2 ; also sheet 2,3,4,6,7,8
GPS_BOOT: U8.P$C4(C4_SAFEBOOT) ; also sheet 2
GPS_DSEL: U8.P$D4(D4_D_SEL) ; also sheet 2
GPS_EXTINT: U8.P$G4(G4_PIO13/EXTINT) ; also sheet 2
GPS_IO14: U8.P$F6(F6_PIO14) ; also sheet 2
GPS_RX: R17.2 ; also sheet 2
GPS_SCL: U8.P$B1(B1_SCL/SPI_CLK) ; also sheet 3
GPS_SDA: U8.P$A2(A2_SDA/SPI_CS_N) ; also sheet 3
GPS_TX: R16.2 ; also sheet 2
N$3: U8.P$J8(J8_RTC_0) Y1.1
N$7: U8.P$J7(J7_RTC_I) Y1.2
N$13: D1.1(C) R5.1
N$14: R5.2 U8.P$H9(H9_V_BCKP) Y2.1
N$23: R16.1 U8.P$J5(J5_TXD/SPI_MISO)
N$24: R17.1 U8.P$J4(J4_RXD/SPI_MOSI)
N$31: ANT1.8(ANT) U8.P$A4(A4_RF_IN)
TIMEPULSE: TP8.TP U8.P$C3(C3_PIO11)
ZOE_CLK: U8.P$2E1(E1_SQI_CLK) U9.6(SCLK)
ZOE_CS: U8.P$D3(D3_SQI_CS_N) U9.1(CS)
ZOE_DIO0: U8.P$D1(D1_SQI_D0) U9.5(SI/SIO0)
ZOE_DIO1: U8.P$C1(C1_SQI_D1) U9.2(SO/SIO1)
ZOE_DIO2: U8.P$E3(E3_SQI_D2) U9.3(WP/SIO2)
ZOE_DIO3: U8.P$F3(F3_SQI_D3) U9.7(RESET/SIO3)
Unconnected: U8.P$A6(A6_RESERVED) U8.P$C5(C5_LNA_EN) U8.P$C6(C6_PIO15) U8.P$E9(E9_RESERVED) U8.P$F1(F1_RESERVED) U8.P$F4(F4_RESERVED) U8.P$F9(F9_RESERVED) U8.P$G5(G5_RESERVED) U8.P$G9(G9_RESERVED)

### Notes on the sheet
- GPS Receiver
- Load capacitors
  built-in
- Quad SPI 16Mb EEPROM

## Sheet 6 of 8: Bluetooth
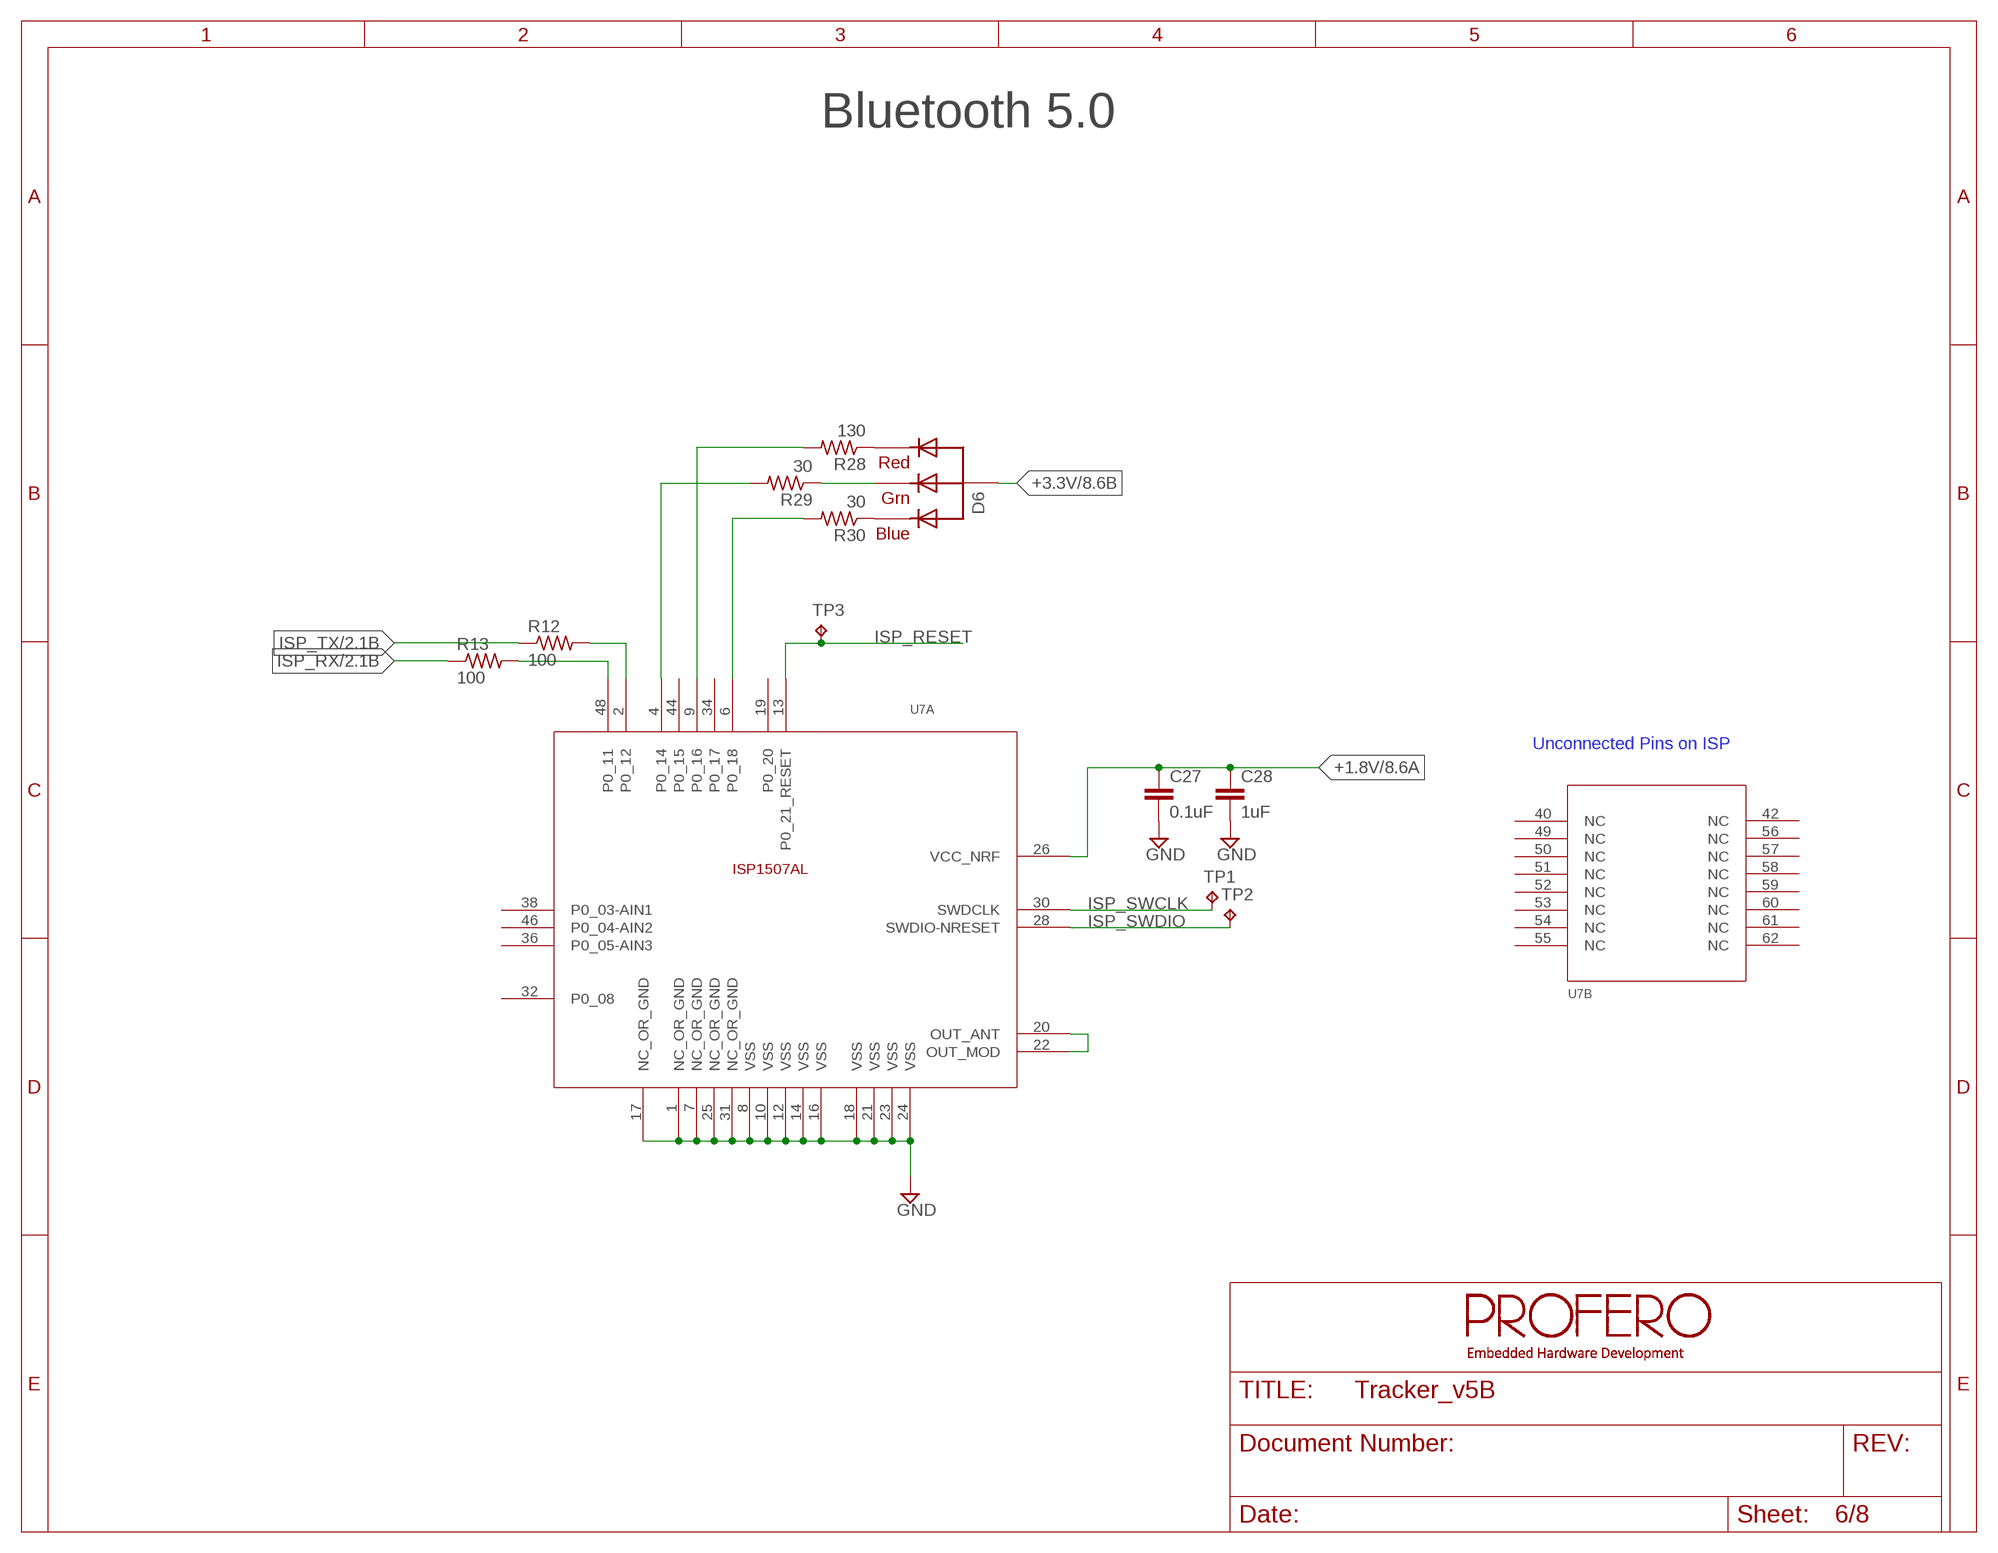
[diagram p5: schematic, sheet 6]

### Parts
C27  0.1uF  C-EUC0201  [C0201]
C28  1uF  C-EUC0201  [C0201]
D6  CLMVC-FKA  [CLMVC-FKA]
R12  100  R-US_R0201  [R0201]
R13  100  R-US_R0201  [R0201]
R28  130  R-US_R0201  [R0201]
R29  30  R-US_R0201  [R0201]
R30  30  R-US_R0201  [R0201]
TP1  TPTP15R  [TP15R]
TP2  TPTP15R  [TP15R]
TP3  TPTP15R  [TP15R]
U7  ISP1507ALISP1507AL_ISP1507-AL  [ISP1507-AL]

### Nets
+1.8V: C27.1 C28.1 U7.26(A:VCC_NRF) ; also sheet 2,4,5,8
+3.3V: D6.B1(VCC) ; also sheet 2,4,5,8
GND: C27.2 C28.2 U7.1(A:NC_OR_GND) U7.7(A:NC_OR_GND) U7.8(A:VSS) U7.10(A:VSS) U7.12(A:VSS) U7.14(A:VSS) U7.16(A:VSS) U7.17(A:NC_OR_GND) U7.18(A:VSS) U7.21(A:VSS) U7.23(A:VSS) U7.24(A:VSS) U7.25(A:NC_OR_GND) U7.31(A:NC_OR_GND) ; also sheet 2,3,4,5,7,8
ISP_RESET: TP3.TP U7.13(A:P0_21_RESET)
ISP_RX: R13.1 ; also sheet 2
ISP_SWCLK: TP1.TP U7.30(A:SWDCLK)
ISP_SWDIO: TP2.TP U7.28(A:SWDIO-NRESET)
ISP_TX: R12.1 ; also sheet 2
N$15: R12.2 U7.2(A:P0_12)
N$22: R13.2 U7.48(A:P0_11)
N$25: U7.20(A:OUT_ANT) U7.22(A:OUT_MOD)
N$46: D6.B4(RED) R28.1
N$49: D6.B3(GREEN) R29.1
N$50: D6.B2(BLUE) R30.1
N$51: R30.2 U7.6(A:P0_18)
N$52: R29.2 U7.4(A:P0_14)
N$53: R28.2 U7.9(A:P0_16)
Unconnected: U7.19(A:P0_20) U7.32(A:P0_08) U7.34(A:P0_17) U7.36(A:P0_05-AIN3) U7.38(A:P0_03-AIN1) U7.40(B:NC) U7.42(B:NC) U7.44(A:P0_15) U7.46(A:P0_04-AIN2) U7.49(B:NC) U7.50(B:NC) U7.51(B:NC) U7.52(B:NC) U7.53(B:NC) U7.54(B:NC) U7.55(B:NC) U7.56(B:NC) U7.57(B:NC) U7.58(B:NC) U7.59(B:NC) U7.60(B:NC) U7.61(B:NC) U7.62(B:NC)

### Notes on the sheet
- Bluetooth 5.0
- Unconnected Pins on ISP

## Sheet 7 of 8: Wireless Charging
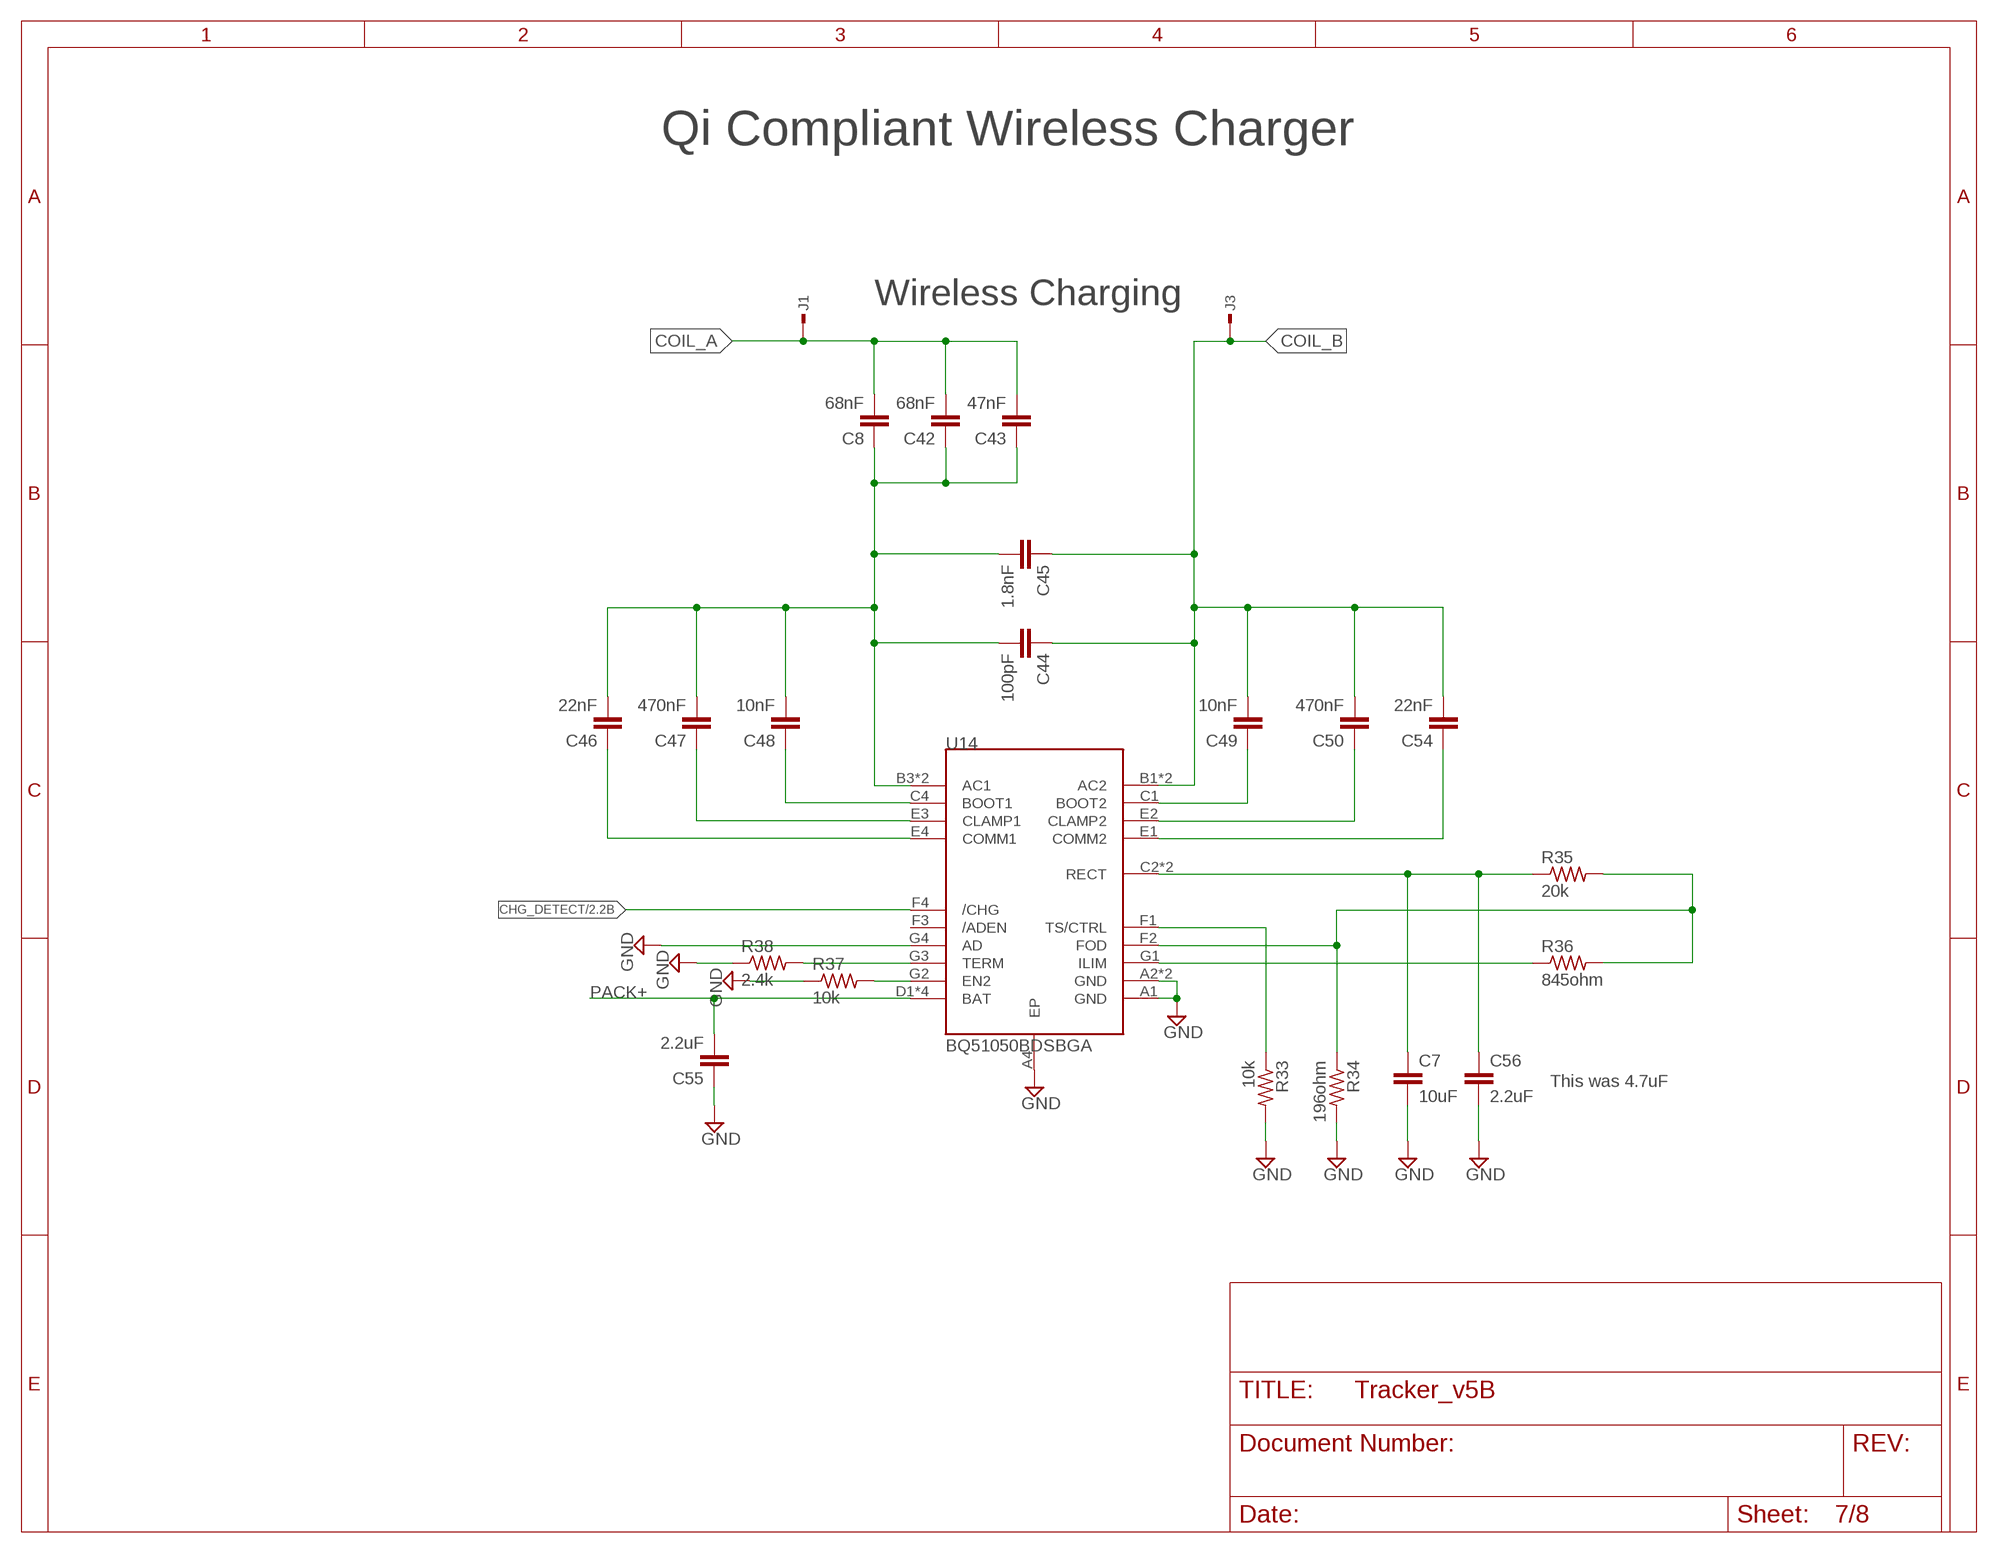
[diagram p6: schematic, sheet 7]

### Parts
C7  10uF  C-EUC0402  [C0402]
C8  68nF  C-EUC0402  [C0402]
C42  68nF  C-EUC0402  [C0402]
C43  47nF  C-EUC0402  [C0402]
C44  100pF  C-EUC0402  [C0402]
C45  1.8nF  C-EUC0402  [C0402]
C46  22nF  C-EUC0402  [C0402]
C47  470nF  C-EUC0402  [C0402]
C48  10nF  C-EUC0402  [C0402]
C49  10nF  C-EUC0402  [C0402]
C50  470nF  C-EUC0402  [C0402]
C54  22nF  C-EUC0402  [C0402]
C55  2.2uF  C-EUC0402  [C0402]
C56  2.2uF  C-EUC0402  [C0402]
J1  SMD_PADPAD_150X75  [PAD_150X75]
J3  SMD_PADPAD_150X75  [PAD_150X75]
R33  10k  R-US_R0201  [R0201]
R34  196ohm  R-US_R0201  [R0201]
R35  20k  R-US_R0201  [R0201]
R36  845ohm  R-US_R0201  [R0201]
R37  10k  R-US_R0201  [R0201]
R38  2.4k  R-US_R0201  [R0201]
U14  BQ51050BDSBGA  [YFP28]

### Nets
CHG_DETECT: U14.F4(/CHG) ; also sheet 2
COIL_A: C8.2 C42.2 C43.2 J1.P$1
COIL_B: C44.1 C45.1 C49.2 C50.2 C54.2 J3.P$1 U14.B1(AC2) U14.B2(AC2)
GND: C7.2 C55.1 C56.2 R33.2 R34.2 R37.1 R38.1 U14.A1(GND) U14.A2(GND) U14.A3(GND) U14.A4(EP) U14.G4(AD) ; also sheet 2,3,4,5,6,8
N$26: C46.1 U14.E4(COMM1)
N$38: C47.1 U14.E3(CLAMP1)
N$39: C48.1 U14.C4(BOOT1)
N$40: C54.1 U14.E1(COMM2)
N$41: C50.1 U14.E2(CLAMP2)
N$42: C49.1 U14.C1(BOOT2)
N$43: C8.1 C42.1 C43.1 C44.2 C45.2 C46.2 C47.2 C48.2 U14.B3(AC1) U14.B4(AC1)
N$44: R33.1 U14.F1(TS/CTRL)
N$45: R34.1 R35.2 R36.2 U14.F2(FOD)
N$47: R36.1 U14.G1(ILIM)
N$48: C7.1 C56.1 R35.1 U14.C2(RECT) U14.C3(RECT)
N$60: R37.2 U14.G2(EN2)
N$61: R38.2 U14.G3(TERM)
PACK+: C55.2 U14.D1(BAT) U14.D2(BAT) U14.D3(BAT) U14.D4(BAT) ; also sheet 8
Unconnected: U14.F3(/ADEN)

### Notes on the sheet
- Qi Compliant Wireless Charger
- Wireless Charging
- This was 4.7uF

## Sheet 8 of 8: Power
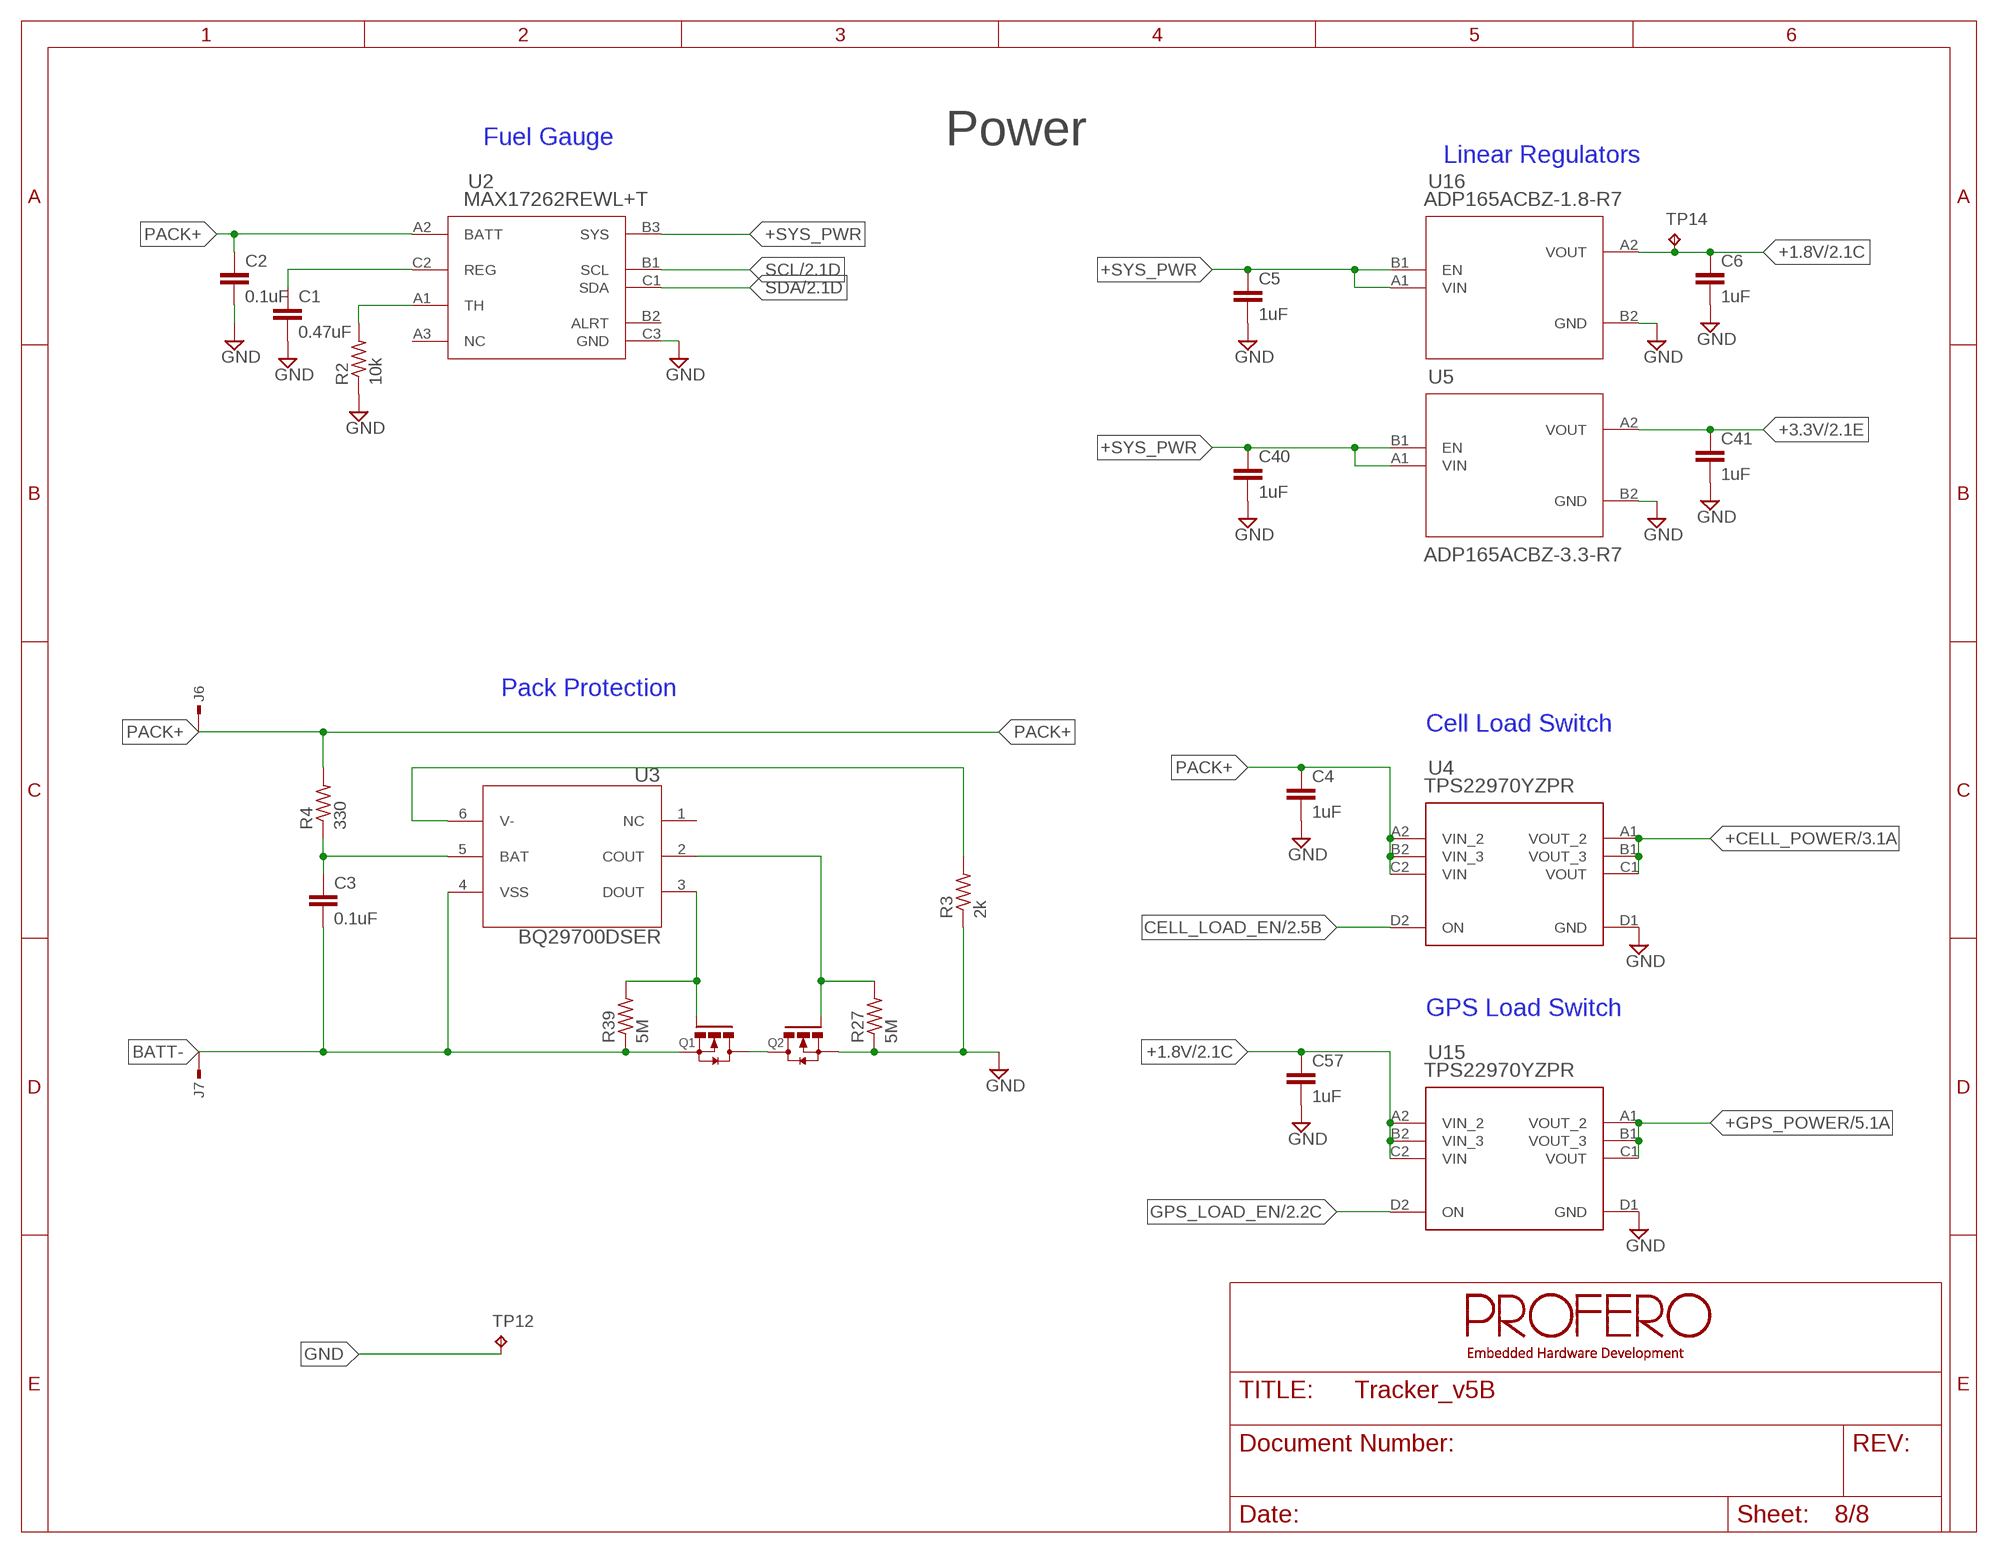
[diagram p7: schematic, sheet 8]

### Parts
C1  0.47uF  C-EUC0201  [C0201]
C2  0.1uF  C-EUC0201  [C0201]
C3  0.1uF  C-EUC0201  [C0201]
C4  1uF  C-EUC0201  [C0201]
C5  1uF  C-EUC0201  [C0201]
C6  1uF  C-EUC0201  [C0201]
C40  1uF  C-EUC0201  [C0201]
C41  1uF  C-EUC0201  [C0201]
C57  1uF  C-EUC0201  [C0201]
J6  SMD_PADPAD_4MMX5MM  [PAD_4MMX5MM]
J7  SMD_PADPAD_4MMX5MM  [PAD_4MMX5MM]
Q1  CSD13385F5T  [YJK3]
Q2  CSD13385F5T  [YJK3]
R2  10k  R-US_R0201  [R0201]
R3  2k  R-US_R0201  [R0201]
R4  330  R-US_R0201  [R0201]
R27  5M  R-US_R0201  [R0201]
R39  5M  R-US_R0201  [R0201]
TP12  TPTP15R  [TP15R]
TP14  TPTP15R  [TP15R]
U2  MAX17262REWL+T  [21-100221A_W91G1+3]
U3  BQ29700DSER  BQ297XXDSER  [DSE0006A]
U4  TPS22970YZPR  [YZP0008ADCD]
U5  ADP165ACBZ-3.3-R7  ADP160ACBZ-3.3-R7  [CB_4_1]
U15  TPS22970YZPR  [YZP0008ADCD]
U16  ADP165ACBZ-1.8-R7  ADP160ACBZ-3.3-R7  [CB_4_1]

### Nets
+1.8V: C6.1 C57.1 TP14.TP U15.A2(VIN_2) U15.B2(VIN_3) U15.C2(VIN) U16.A2(VOUT) ; also sheet 2,4,5,6
+3.3V: C41.1 U5.A2(VOUT) ; also sheet 2,4,5,6
+CELL_POWER: U4.A1(VOUT_2) U4.B1(VOUT_3) U4.C1(VOUT) ; also sheet 3
+GPS_POWER: U15.A1(VOUT_2) U15.B1(VOUT_3) U15.C1(VOUT) ; also sheet 5
+SYS_PWR: C5.1 C40.1 U2.B3(SYS) U5.A1(VIN) U5.B1(EN) U16.A1(VIN) U16.B1(EN)
BATT-: C3.2 J7.P$1 Q1.2(S) R39.1 U3.4(VSS)
CELL_LOAD_EN: U4.D2(ON) ; also sheet 2
GND: C1.2 C2.2 C4.2 C5.2 C6.2 C40.2 C41.2 C57.2 Q2.2(S) R2.1 R3.1 R27.1 TP12.TP U2.C3(GND) U4.D1(GND) U5.B2(GND) U15.D1(GND) U16.B2(GND) ; also sheet 2,3,4,5,6,7
GPS_LOAD_EN: U15.D2(ON) ; also sheet 2
N$1: C1.1 U2.C2(REG)
N$2: R2.2 U2.A1(TH)
N$4: Q1.3(D) Q2.3(D)
N$5: Q1.1(G) R39.2 U3.3(DOUT)
N$6: Q2.1(G) R27.2 U3.2(COUT)
N$8: C3.1 R4.1 U3.5(BAT)
N$56: R3.2 U3.6(V-)
PACK+: C2.1 C4.1 J6.P$1 R4.2 U2.A2(BATT) U4.A2(VIN_2) U4.B2(VIN_3) U4.C2(VIN) ; also sheet 7
SCL: U2.B1(SCL) ; also sheet 2,4
SDA: U2.C1(SDA) ; also sheet 2,4
Unconnected: U2.A3(NC) U2.B2(ALRT) U3.1(NC)

### Notes on the sheet
- Fuel Gauge | Power
- Linear Regulators
- Pack Protection
- Cell Load Switch
- GPS Load Switch

## Power pins joined to a net without a drawn wire
VBAT: U1.B2(B:VBAT)

## Library data of the parts
ANT1 = Profero-RF:SGGP.25.2.A.02: 1.575GHz, 1.602GHz GLONASS, GPS Ceramic Patch RF Antenna 3.3dBi Solder Surface Mount
C1-C23 C25-C57 L2 = rcl:C-EU: CAPACITOR, European symbol; SPICEPREFIX: C
C24 = Capacitor:C-POL: Capacitor Polarised - Generic; CATEGORY: Capacitor
D1 = Profero_Technology:BAT30F4: Diode Schottky 30V 300mA Surface Mount 0201
D2 D6 = Profero-LEDs:CLMVC-FKA: Red, Green, Blue (RGB) 622nm Red, 530nm Green, 470nm Blue LED Indication - Discrete 2V Red, 3V Green, 3V Blue 4-SMD, J-Lead
J1 J3 J6 J7 = Profero-Pads:SMD_PAD: Square SMD Pad Collection
Q1 Q2 = Profero-DiscreteSemi:CSD13385F5T: N-Channel 12V 4.3A (Ta) 500mW (Ta) Surface Mount 3-PICOSTAR; COPYRIGHT: Copyright (C) 2018 Accelerated Designs. All rights reserved; MANUFACTURER_PART_NUMBER: CSD13385F5T; SOURCELIBRARY: TI_2019-05-21; VENDOR: Texas Instruments
R1-R39 = rcl:R-US_: RESISTOR, American symbol; SPICEPREFIX: R
S1 = Profero-Connectors:EVQ-7P(J/A): PANASONIC SWITCH TACTILE SPST-NO 0.05A 12V
TP1-TP14 TP17-TP27 = testpad:TP: Test pad
U1 = Profero-Processors:STM32L412RBI6: ARM® Cortex®-M4 STM32L4 Microcontroller IC 32-Bit 80MHz 128KB (128K x 8) FLASH 64-UFBGA (5x5); MANUFACTURER_PART_NUMBER: stm32l4_ufbga64_t5; VENDOR: STMicroelectronics
U2 = Profero-Power:MAX17262REWL+T: 5.2μA 1-Cell Fuel Gauge with ModelGauge m5 EZ and Internal Current Sensing; BUILT_BY: EMA_Jessica; COPYRIGHT: Copyright (C) 2016 Accelerated Designs. All rights reserved; MANUFACTURER_PART_NUMBER: MAX17262REWL+T; SOURCELIBRARY: Maxim_2018-11-30; VENDOR: Maxim Integrated Products
U3 = Profero-Power:BQ297XXDSER: BQ297xx Cost-Effective Voltage and Current Protection Integrated Circuit for Single-Cell Li-Ion and Li-Polymer Batteries; ALTERNATE_PARTNUMBER: TPS72710DSET; APPLICATION_BUILDNUMBER: *; COMPTYPE: IC; MANUFACTURER: Texas Instruments; MOUNTTYPE: SMT; PACKAGEREFERENCE: DSE0006A; PARTNUMBER: TPS72710DSER; PIN_COUNT: 6; REFDES: RefDes; ROHS: Y; TYPE: TYPE
U4 U15 = Profero-Power:TPS22970YZPR: TPS22970 3.6-V, 4-A, 4.7-mΩOn-Resistance Load Switch; MANUFACTURER: Texas Instruments; PARTNUMBER: TPS22970YZPR; REFDES: RefDes; TYPE: TYPE
U5 U16 = ASSIST:ADP160ACBZ-3.3-R7: ADP160ACBZ- Linear Voltage Regulator IC Positive Fixed 1 Output 150mA 4-WLCSP (0.97x0.97); DIGI#: ADP160ACBZ-3.3-R7CT-ND; MANF#: ADP160ACBZ-3.3-R7; URL: https://www.digikey.com/short/p17qrf
U7 = Profero-Processors:ISP1507AL: ISP Smart Bluetooth Module; BOI: QFN 8 x 8; BOI-METRIC: QFN 8 x 8; DESIG: BLE Module; FAB: Insight SiP; ISP_PART: ISP1507AL; REF: ISP1507AL
U8 = Profero-ICs:ZOE-M8B: ZOE-M8 RF Receiver BeiDou, Galileo, GLONASS, GNSS, GPS -160dBm; DESCRIPTION: ZOE-M8 RF Receiver BeiDou, Galileo, GLONASS, GNSS, GPS -160dBm; MF: U-Blox America; MP: ZOE-M8B; PACKAGE: SMD-51 U-Blox America
U9 = Profero_ICs_:MX25R1635FZUIL0: FLASH - NOR Memory IC 16Mb (2M x 8) SPI - Quad I/O 33MHz 8-USON (2x3); BUILT_BY: EMA_Cory; COPYRIGHT: Copyright (C) 2018 Accelerated Designs. All rights reserved; MANUFACTURER_PART_NUMBER: MX25R1635FZUIL0; SOURCELIBRARY: Macronix_2019-12-02; VENDOR: Macronix
U10 = Profero-Sensors:LSM6DSMTR: iNEMO inertial module: 3D accelerometer and 3D gyroscope; DESCRIPTION: Accelerometer, Gyroscope, Temperature, 6 Axis Sensor I²C, SPI Output; DIGI-KEY_PART_NUMBER: 497-16696-1-ND; DIGI-KEY_PURCHASE_URL: https://www.digikey.com/product-detail/en/stmicroelectronics/LSM6DSMTR/497-16696-1-ND/6192778?utm_source=snapeda&utm_medium=aggregator&utm_campaign=symbol; MF: STMicroelectronics; MP: LSM6DSMTR; PACKAGE: VFLGA-14 STMicroelectronics
U11 = Profero-Processors:SARA-R4: Ublox LTE-M / NB-IoT / EGPRS modules with Secure Cloud
U12 = Profero-ICs:SIM-ST-MFF2: GLOBAL IOT EMBEDDED SIM CHIP; DESCRIPTION: GLOBAL IOT EMBEDDED SIM CHIP; DIGI-KEY_PART_NUMBER: 1887-1002-1-ND; DIGI-KEY_PURCHASE_URL: https://www.digikey.com/product-detail/en/hologram-inc/SIM-ST-MFF2/1887-1002-1-ND/9489900?utm_source=snapeda&utm_medium=aggregator&utm_campaign=symbol; MF: Hologram, Inc.; MP: SIM-ST-MFF2; PACKAGE: None
U13 = Profero-Memory:AT25QL128A-UUE-T: FLASH Memory IC 128Mb (16M x 8) SPI - Quad I/O, QPI 104MHz 21-WLCSP (3.02x3.29)
U14 = Profero-Power:BQ51050B: BQ51050B - Wireless Power Receiver.
U$1 = Profero-RF:ANT-LTE-SP610-T: 700MHz, 850MHz, 900MHz, 1.8GHz, 1.9GHz, 2.1GHz, 2.4GHz, 2.6GHz CAT-M1, Cellular, GSM, LTE, LTE-M, LPWA, NB-IOT, UMTS, 4G Chip RF Antenna 698MHz ~ 960MHz, 1.71GHz ~ 2.17GHz, 2.3GHz ~ 2.4GHz, 2.49GHz ~ 2.69GHz 5.1dBi, 5.3dBi, 4.9dBi, 2.7dBi Solder Surface Mount
Y1 Y3 = Crystals_Oscillators:ECS-.327-12.5-1210-TR: CRYSTAL 32.7680KHZ 12.5PF SMD Manufacturer's datasheet <https://ecsxtal.com/store/pdf/ECX-1210.pdf>; CREATED_BY: PCBLayout.com; DIGIKEY_PART_NUMBER: XC2282TR-ND; MANUFACTURER: ECS Inc.; MPN: ECS-.327-12.5-1210-TR; PACKAGE: 2-SMD
Y2 = Profero-Power:ML614-TZ21: Coin, 6.8mm 3V Lithium Battery Rechargeable (Secondary) 3.4mAh
Y4 = Profero-Crystals:ECS-160-9-37-CKM-TR: SMD Crystal 2.0 x 1.6 x 0.45 mm ceramic package; DESCRIPTION: 16MHz ±10ppm Crystal 9pF 100 Ohms 4-SMD, No Lead; DIGI-KEY_PART_NUMBER: XC2630CT-ND; DIGI-KEY_PURCHASE_URL: https://www.digikey.com/product-detail/en/ecs-inc/ECS-160-9-37-CKM-TR/XC2630CT-ND/8023565?utm_source=snapeda&utm_medium=aggregator&utm_campaign=symbol; MF: ECS Inc.; MP: ECS-160-9-37-CKM-TR; PACKAGE: SMD-4 ECS International

## Net classes
1 diff: width 0.203 mm, clearance 0.127 mm